# Altium project Banker.PrjPCB (part 1 of 5)
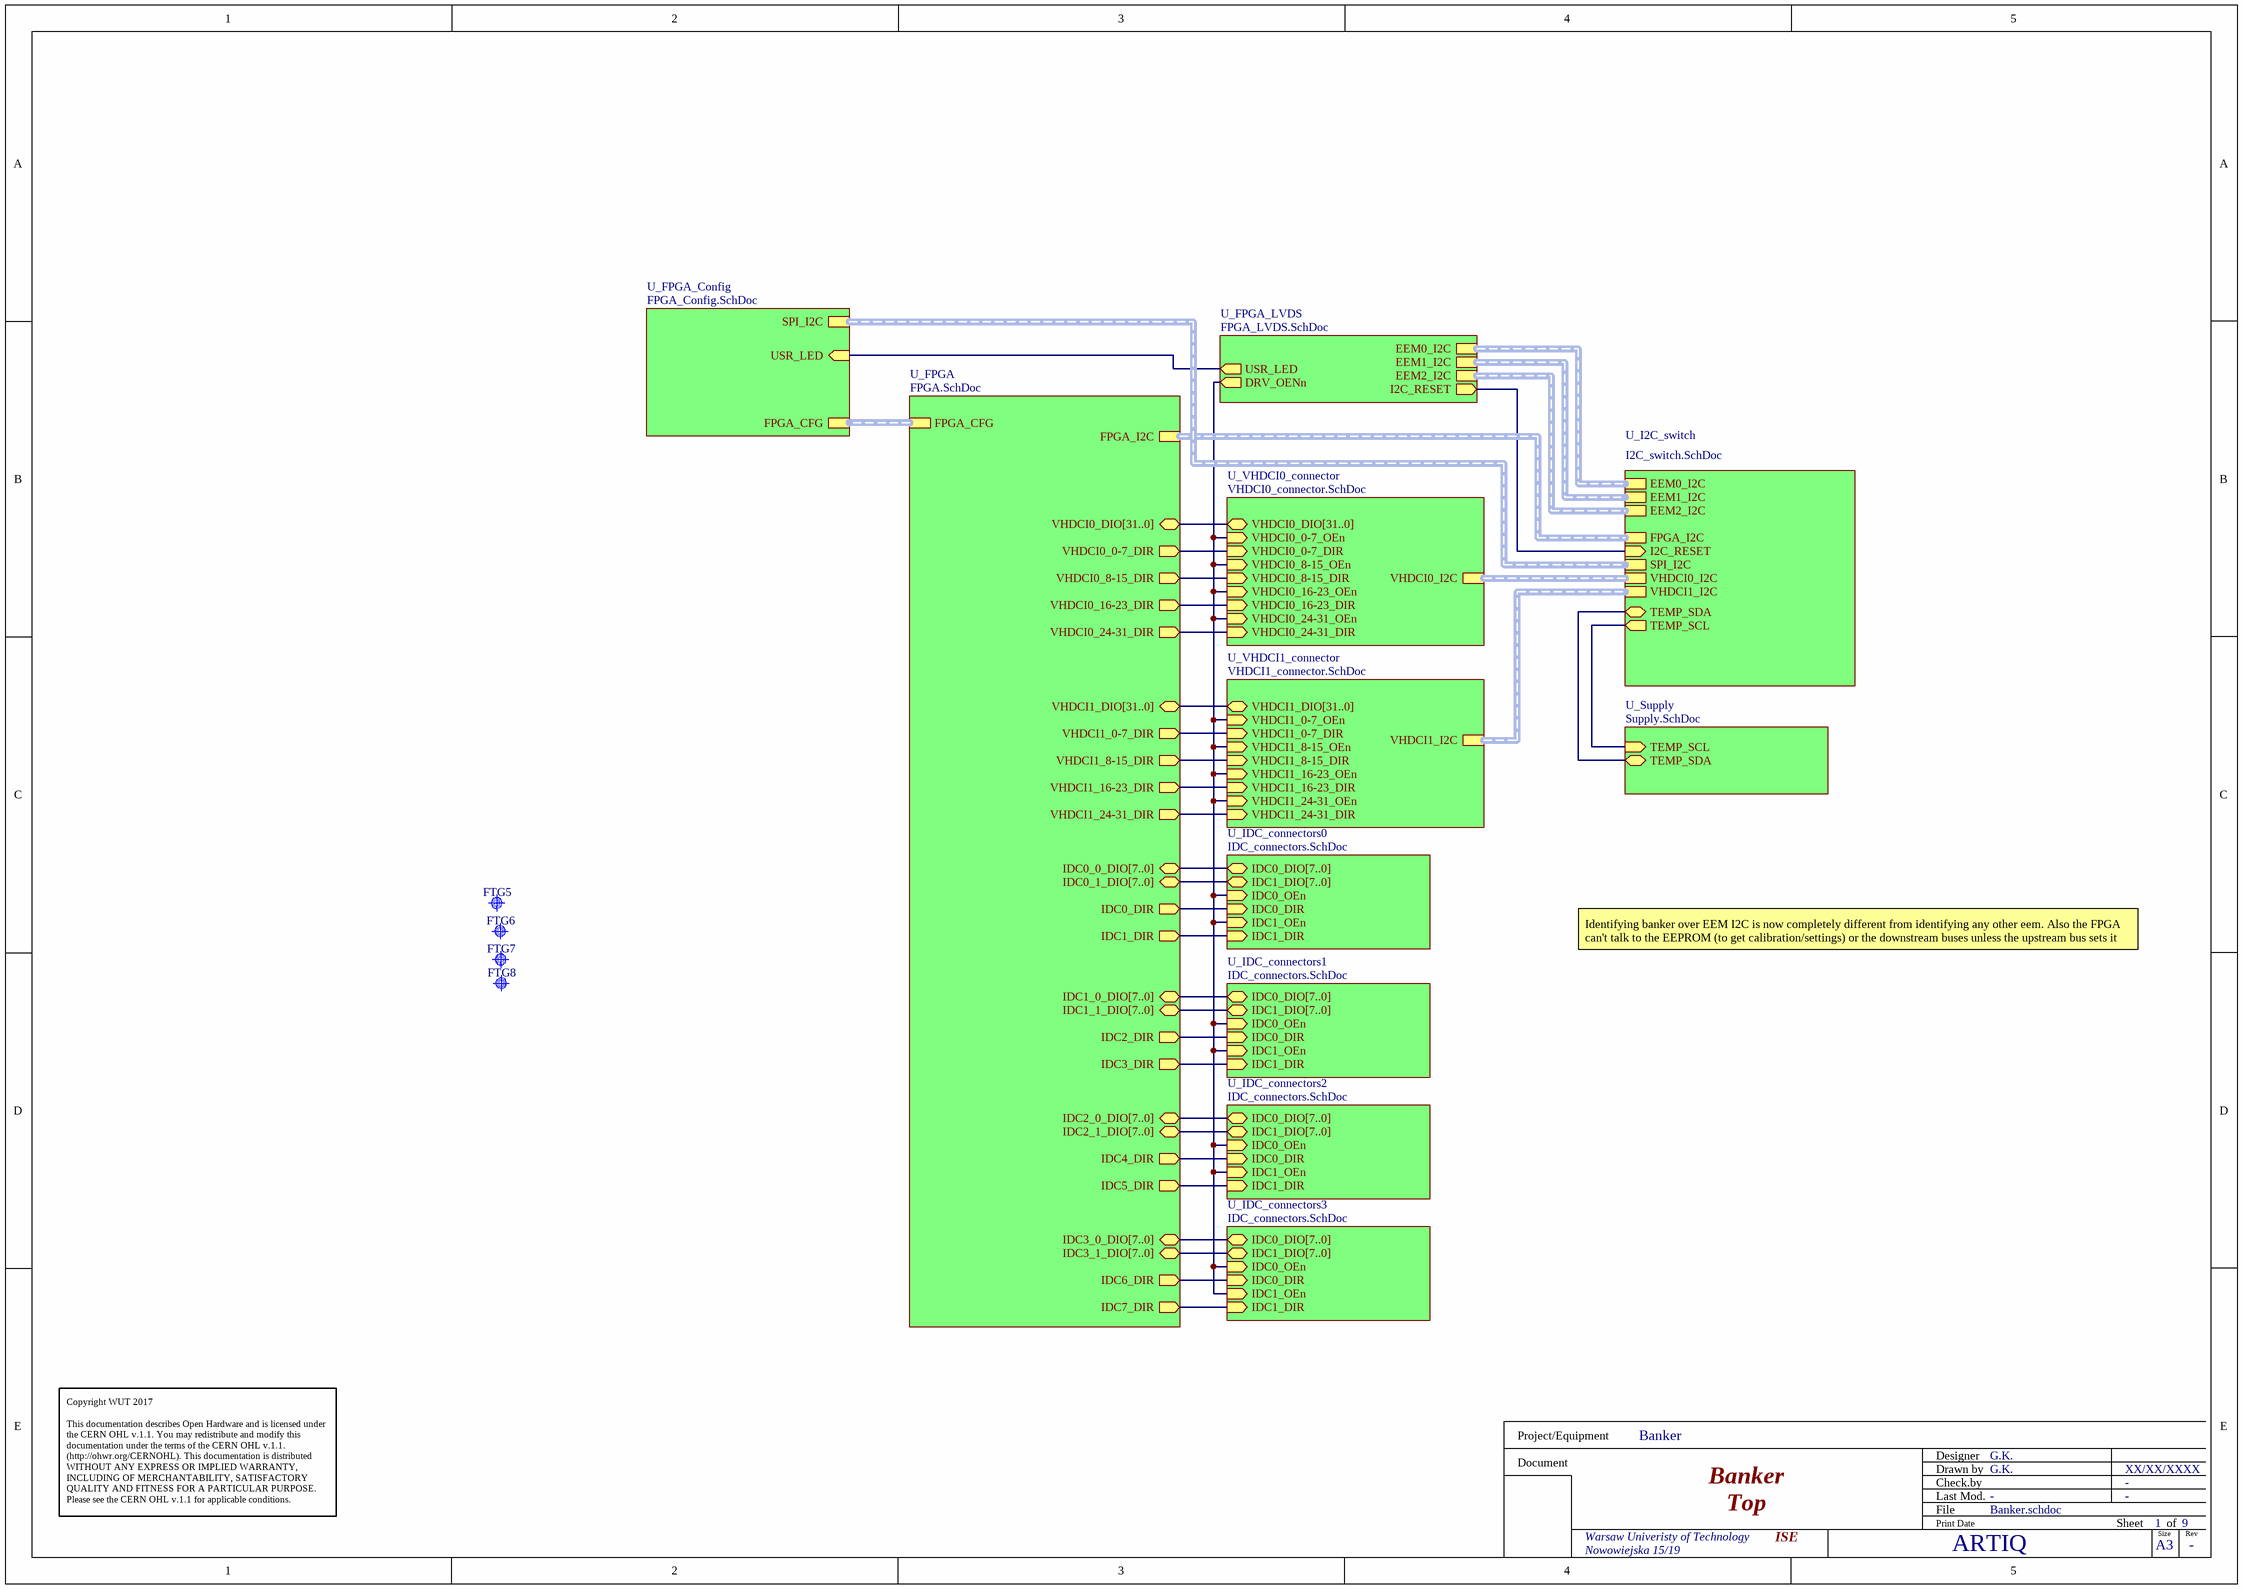
[diagram p0: Banker.schdoc]
9 sheets, 525 parts. Net scope: hierarchical (ports join the sheet entries above them; power ports are global).
Board files: Banker.PCBDOC, Panel_Banker.PcbDoc
Sheets:
  Banker.schdoc
    U_FPGA_LVDS = FPGA_LVDS.SchDoc
    U_VHDCI0_connector = VHDCI0_connector.SchDoc
    U_IDC_connectors0 = IDC_connectors.SchDoc
    U_VHDCI1_connector = VHDCI1_connector.SchDoc
    U_IDC_connectors1 = IDC_connectors.SchDoc
    U_IDC_connectors2 = IDC_connectors.SchDoc
    U_IDC_connectors3 = IDC_connectors.SchDoc
    U_FPGA = FPGA.SchDoc
    U_I2C_switch = I2C_switch.SchDoc
    U_Supply = Supply.SchDoc
    U_FPGA_Config = FPGA_Config.SchDoc

## Sheet Banker.schdoc: Banker
size 420 x 297 mm; Author: G.K.; CompanyName: WUT; DrawnBy: G.K.; Organization: CERN; Address1: Warsaw Univeristy of Technology; Address2: Nowowiejska 15/19; DocumentNumber: 1; Revision: -; SheetNumber: 1; SheetTotal: 9; EDA_Number: ARTIQ; Projet: Banker; ModifiedBy: -; CreateDate: XX/XX/XXXX; CheckedDate: -; Title2: Top; DivGrp: ISE; Designer: G.K.; ModifiedDate: -; ProjectName: ADC/DAC MEZZANINE

### Parts
FTG5  Use only in PCB  [FIDUCIAL_TOP_C100-200]  (value not drawn)
FTG6  Use only in PCB  [FIDUCIAL_TOP_S100-200]  (value not drawn)
FTG7  Use only in PCB  [FIDUCIAL_TOP_S200-400]  (value not drawn)
FTG8  Use only in PCB  [FIDUCIAL_TOP_S100-200]  (value not drawn)

### Sub-sheets
U_FPGA = FPGA.SchDoc: VHDCI0_DIO[31..0] (bidir), VHDCI1_DIO[31..0] (bidir), IDC0_0_DIO[7..0] (bidir), IDC0_1_DIO[7..0] (bidir), IDC0_DIR (out), IDC1_DIR (out), VHDCI1_0-7_DIR (out), VHDCI1_8-15_DIR (out), VHDCI1_16-23_DIR (out), VHDCI1_24-31_DIR (out), VHDCI0_0-7_DIR (out), VHDCI0_8-15_DIR (out), VHDCI0_16-23_DIR (out), VHDCI0_24-31_DIR (out), IDC2_DIR (out), IDC3_DIR (out), IDC1_0_DIO[7..0] (bidir), IDC1_1_DIO[7..0] (bidir), IDC2_0_DIO[7..0] (bidir), IDC2_1_DIO[7..0] (bidir), IDC3_0_DIO[7..0] (bidir), IDC3_1_DIO[7..0] (bidir), IDC7_DIR (out), IDC6_DIR (out), IDC4_DIR (out), IDC5_DIR (out), FPGA_I2C (harness I2C), FPGA_CFG (harness FPGA_CFG)
U_FPGA_Config = FPGA_Config.SchDoc: FPGA_CFG (harness FPGA_CFG), SPI_I2C (harness I2C), USR_LED (in)
U_FPGA_LVDS = FPGA_LVDS.SchDoc: EEM0_I2C (harness I2C), EEM1_I2C (harness I2C), EEM2_I2C (harness I2C), USR_LED (out), I2C_RESET (out), DRV_OENn (out)
U_I2C_switch = I2C_switch.SchDoc: EEM0_I2C (harness I2C), EEM1_I2C (harness I2C), VHDCI0_I2C (harness I2C), VHDCI1_I2C (harness I2C), EEM2_I2C (harness I2C), FPGA_I2C (harness I2C), SPI_I2C (harness I2C), I2C_RESET (in), TEMP_SCL (out), TEMP_SDA (bidir)
U_IDC_connectors0 = IDC_connectors.SchDoc: IDC0_DIO[7..0] (bidir), IDC1_DIO[7..0] (bidir), IDC0_OEn (in), IDC0_DIR (in), IDC1_DIR (in), IDC1_OEn (in)
U_IDC_connectors1 = IDC_connectors.SchDoc: IDC0_DIO[7..0] (bidir), IDC1_DIO[7..0] (bidir), IDC0_OEn (in), IDC0_DIR (in), IDC1_DIR (in), IDC1_OEn (in)
U_IDC_connectors2 = IDC_connectors.SchDoc: IDC0_DIO[7..0] (bidir), IDC1_DIO[7..0] (bidir), IDC0_OEn (in), IDC0_DIR (in), IDC1_DIR (in), IDC1_OEn (in)
U_IDC_connectors3 = IDC_connectors.SchDoc: IDC0_DIO[7..0] (bidir), IDC1_DIO[7..0] (bidir), IDC0_OEn (in), IDC0_DIR (in), IDC1_DIR (in), IDC1_OEn (in)
U_Supply = Supply.SchDoc: TEMP_SCL (in), TEMP_SDA (bidir)
U_VHDCI0_connector = VHDCI0_connector.SchDoc: VHDCI0_I2C (harness I2C), VHDCI0_DIO[31..0] (bidir), VHDCI0_0-7_OEn (in), VHDCI0_0-7_DIR (in), VHDCI0_8-15_OEn (in), VHDCI0_8-15_DIR (in), VHDCI0_16-23_OEn (in), VHDCI0_16-23_DIR (in), VHDCI0_24-31_OEn (in), VHDCI0_24-31_DIR (in)
U_VHDCI1_connector = VHDCI1_connector.SchDoc: VHDCI1_DIO[31..0] (bidir), VHDCI1_I2C (harness I2C), VHDCI1_0-7_OEn (in), VHDCI1_0-7_DIR (in), VHDCI1_8-15_OEn (in), VHDCI1_8-15_DIR (in), VHDCI1_16-23_OEn (in), VHDCI1_16-23_DIR (in), VHDCI1_24-31_OEn (in), VHDCI1_24-31_DIR (in)

### Nets
DRV_OENn: sheet U_FPGA_LVDS/DRV_OENn, sheet U_VHDCI0_connector/VHDCI0_0-7_OEn, sheet U_VHDCI0_connector/VHDCI0_8-15_OEn, sheet U_VHDCI0_connector/VHDCI0_16-23_OEn, sheet U_VHDCI0_connector/VHDCI0_24-31_OEn, sheet U_IDC_connectors0/IDC0_OEn, sheet U_IDC_connectors0/IDC1_OEn, sheet U_VHDCI1_connector/VHDCI1_0-7_OEn, sheet U_VHDCI1_connector/VHDCI1_8-15_OEn, sheet U_VHDCI1_connector/VHDCI1_16-23_OEn, sheet U_VHDCI1_connector/VHDCI1_24-31_OEn, sheet U_IDC_connectors1/IDC0_OEn, sheet U_IDC_connectors1/IDC1_OEn, sheet U_IDC_connectors2/IDC0_OEn, sheet U_IDC_connectors2/IDC1_OEn, sheet U_IDC_connectors3/IDC0_OEn, sheet U_IDC_connectors3/IDC1_OEn
IDC0_DIR: sheet U_IDC_connectors0/IDC0_DIR, sheet U_FPGA/IDC0_DIR
IDC1_DIR: sheet U_IDC_connectors0/IDC1_DIR, sheet U_FPGA/IDC1_DIR
IDC2_DIR: sheet U_IDC_connectors1/IDC0_DIR, sheet U_FPGA/IDC2_DIR
IDC3_DIR: sheet U_IDC_connectors1/IDC1_DIR, sheet U_FPGA/IDC3_DIR
IDC4_DIR: sheet U_IDC_connectors2/IDC0_DIR, sheet U_FPGA/IDC4_DIR
IDC5_DIR: sheet U_IDC_connectors2/IDC1_DIR, sheet U_FPGA/IDC5_DIR
IDC6_DIR: sheet U_IDC_connectors3/IDC0_DIR, sheet U_FPGA/IDC6_DIR
IDC7_DIR: sheet U_IDC_connectors3/IDC1_DIR, sheet U_FPGA/IDC7_DIR
TEMP_SCL: sheet U_I2C_switch/TEMP_SCL, sheet U_Supply/TEMP_SCL
TEMP_SDA: sheet U_I2C_switch/TEMP_SDA, sheet U_Supply/TEMP_SDA
USR_LED: sheet U_FPGA_LVDS/USR_LED, sheet U_FPGA_Config/USR_LED
VHDCI0_0-7_DIR: sheet U_VHDCI0_connector/VHDCI0_0-7_DIR, sheet U_FPGA/VHDCI0_0-7_DIR
VHDCI0_8-15_DIR: sheet U_VHDCI0_connector/VHDCI0_8-15_DIR, sheet U_FPGA/VHDCI0_8-15_DIR
VHDCI0_16-23_DIR: sheet U_VHDCI0_connector/VHDCI0_16-23_DIR, sheet U_FPGA/VHDCI0_16-23_DIR
VHDCI0_24-31_DIR: sheet U_VHDCI0_connector/VHDCI0_24-31_DIR, sheet U_FPGA/VHDCI0_24-31_DIR
VHDCI1_0-7_DIR: sheet U_VHDCI1_connector/VHDCI1_0-7_DIR, sheet U_FPGA/VHDCI1_0-7_DIR
VHDCI1_8-15_DIR: sheet U_VHDCI1_connector/VHDCI1_8-15_DIR, sheet U_FPGA/VHDCI1_8-15_DIR
VHDCI1_16-23_DIR: sheet U_VHDCI1_connector/VHDCI1_16-23_DIR, sheet U_FPGA/VHDCI1_16-23_DIR
VHDCI1_24-31_DIR: sheet U_VHDCI1_connector/VHDCI1_24-31_DIR, sheet U_FPGA/VHDCI1_24-31_DIR
NetR148_1: sheet U_FPGA_LVDS/I2C_RESET, sheet U_I2C_switch/I2C_RESET

### Buses and harness runs
bus sheet U_FPGA/IDC0_0_DIO[7..0] = sheet U_IDC_connectors0/IDC0_DIO[7..0]
bus sheet U_FPGA/IDC0_1_DIO[7..0] = sheet U_IDC_connectors0/IDC1_DIO[7..0]
bus sheet U_FPGA/IDC1_0_DIO[7..0] = sheet U_IDC_connectors1/IDC0_DIO[7..0]
bus sheet U_FPGA/IDC1_1_DIO[7..0] = sheet U_IDC_connectors1/IDC1_DIO[7..0]
bus sheet U_FPGA/IDC2_0_DIO[7..0] = sheet U_IDC_connectors2/IDC0_DIO[7..0]
bus sheet U_FPGA/IDC2_1_DIO[7..0] = sheet U_IDC_connectors2/IDC1_DIO[7..0]
bus sheet U_FPGA/IDC3_0_DIO[7..0] = sheet U_IDC_connectors3/IDC0_DIO[7..0]
bus sheet U_FPGA/IDC3_1_DIO[7..0] = sheet U_IDC_connectors3/IDC1_DIO[7..0]
bus sheet U_FPGA/VHDCI0_DIO[31..0] = sheet U_VHDCI0_connector/VHDCI0_DIO[31..0]
bus sheet U_FPGA/VHDCI1_DIO[31..0] = sheet U_VHDCI1_connector/VHDCI1_DIO[31..0]
harness sheet U_FPGA/FPGA_CFG = sheet U_FPGA_Config/FPGA_CFG
harness sheet U_FPGA/FPGA_I2C = sheet U_I2C_switch/FPGA_I2C
harness sheet U_FPGA_Config/SPI_I2C = sheet U_I2C_switch/SPI_I2C
harness sheet U_FPGA_LVDS/EEM0_I2C = sheet U_I2C_switch/EEM0_I2C
harness sheet U_FPGA_LVDS/EEM1_I2C = sheet U_I2C_switch/EEM1_I2C
harness sheet U_FPGA_LVDS/EEM2_I2C = sheet U_I2C_switch/EEM2_I2C
harness sheet U_I2C_switch/VHDCI0_I2C = sheet U_VHDCI0_connector/VHDCI0_I2C
harness sheet U_I2C_switch/VHDCI1_I2C = sheet U_VHDCI1_connector/VHDCI1_I2C

### Notes on the sheet
- Identifying banker over EEM I2C is now completely different from identifying any other eem. Also the FPGA can't talk to the EEPROM (to get calibration/settings) or the downstream buses unless the upstream bus sets it up.
- Copyright WUT 2017
  This documentation describes Open Hardware and is licensed under the CERN OHL v.1.1. You may redistribute and modify this documentation under the terms of the CERN OHL v.1.1. (http://ohwr.org/CERNOHL). This documentation is distributed WITHOUT ANY EXPRESS OR IMPLIED WARRANTY, INCLUDING OF MERCHANTABILITY, SATISFACTORY QUALITY AND FITNESS FOR A PARTICULAR PURPOSE. Please see the CERN OHL v.1.1 for applicable conditions.
- Project/Equipment
- Document
- Designer
- Drawn by
- Check.by
- File
- Last Mod.
- Print Date
- Sheet
- Size
- A3
- of
- Rev

### Library data of the parts
FTG5 = FIDUCIAL_TARGET_C100-200: Fiducial Target; Part Description: Round Fiducial Target, Top Layer, 1.0mm, Top Solder 2.0mm, Keepout =2.0mm; Mounted: No; Part Number: FIDUCIAL_TARGET_C100-200; Component Kind: Standard (No BOM); Component Type: Standard (No BOM); Pin Count: 1; Family: Fiducial; Socket: No; SMD: Yes; Sense: No; Status: None; ComponentHeight: 0mm; HelpURL: Undefined; Author: CERN DEM JLC; CreateDate: 09.02.2010; LatestRevisionDate: 04.04.2012; PackageDescription: Round Fiducial Target, Top Layer, 1.0mm, Top Solder 2.0mm, Keepout =2.0mm
FTG6 FTG8 = FIDUCIAL_TARGET_S100-200: Fiducial Target; Part Description: Square Fiducial Target, Top Layer, 1.0mm, Top Solder 2.0mm, Keepout =2.0mm; Mounted: No; Part Number: FIDUCIAL_TARGET_S100-200; Component Kind: Standard (No BOM); Component Type: Standard (No BOM); Pin Count: 1; Family: Fiducial; Socket: No; SMD: Yes; Sense: No; Status: None; ComponentHeight: 0mm; HelpURL: Undefined; Author: CERN DEM JLC; CreateDate: 09.02.2010; LatestRevisionDate: 04.04.2012; PackageDescription: Square Fiducial Target, Top Layer, 1.0mm, Top Solder 2.0mm, Keepout =2.0mm
FTG7 = FIDUCIAL_TARGET_S200-400: Fiducial Target; Part Description: Square Fiducial Target, Top Layer, 2.0mm, Top Solder 4.0mm, Keepout =4.0mm; Mounted: No; Part Number: FIDUCIAL_TARGET_S200-400; Component Kind: Standard (No BOM); Component Type: Standard (No BOM); Pin Count: 1; Family: Fiducial; Socket: No; SMD: Yes; Sense: No; Status: None; ComponentHeight: 0mm; HelpURL: Undefined; Author: CERN DEM JLC; CreateDate: 02.06.2008; LatestRevisionDate: 04.04.2012; PackageDescription: Square Fiducial Target, Top Layer, 2.0mm, Top Solder 4.0mm, Keepout =4.0mm

## Sheet FPGA_LVDS.SchDoc: FPGA LVDS bank
size 420 x 297 mm; Author: G.K.; CompanyName: WUT; DrawnBy: G.K.; Organization: CERN; Address1: Warsaw Univeristy of Technology; Address2: Nowowiejska 15/19; DocumentNumber: 6; Revision: -; SheetNumber: 6; SheetTotal: 9; EDA_Number: ARTIQ; Projet: Banker; ModifiedBy: -; CreateDate: XX/XX/XXXX; CheckedDate: -; Title2: EEM connector; DivGrp: ISE; Designer: G.K.; ModifiedDate: -; ProjectName: ADC/DAC MEZZANINE
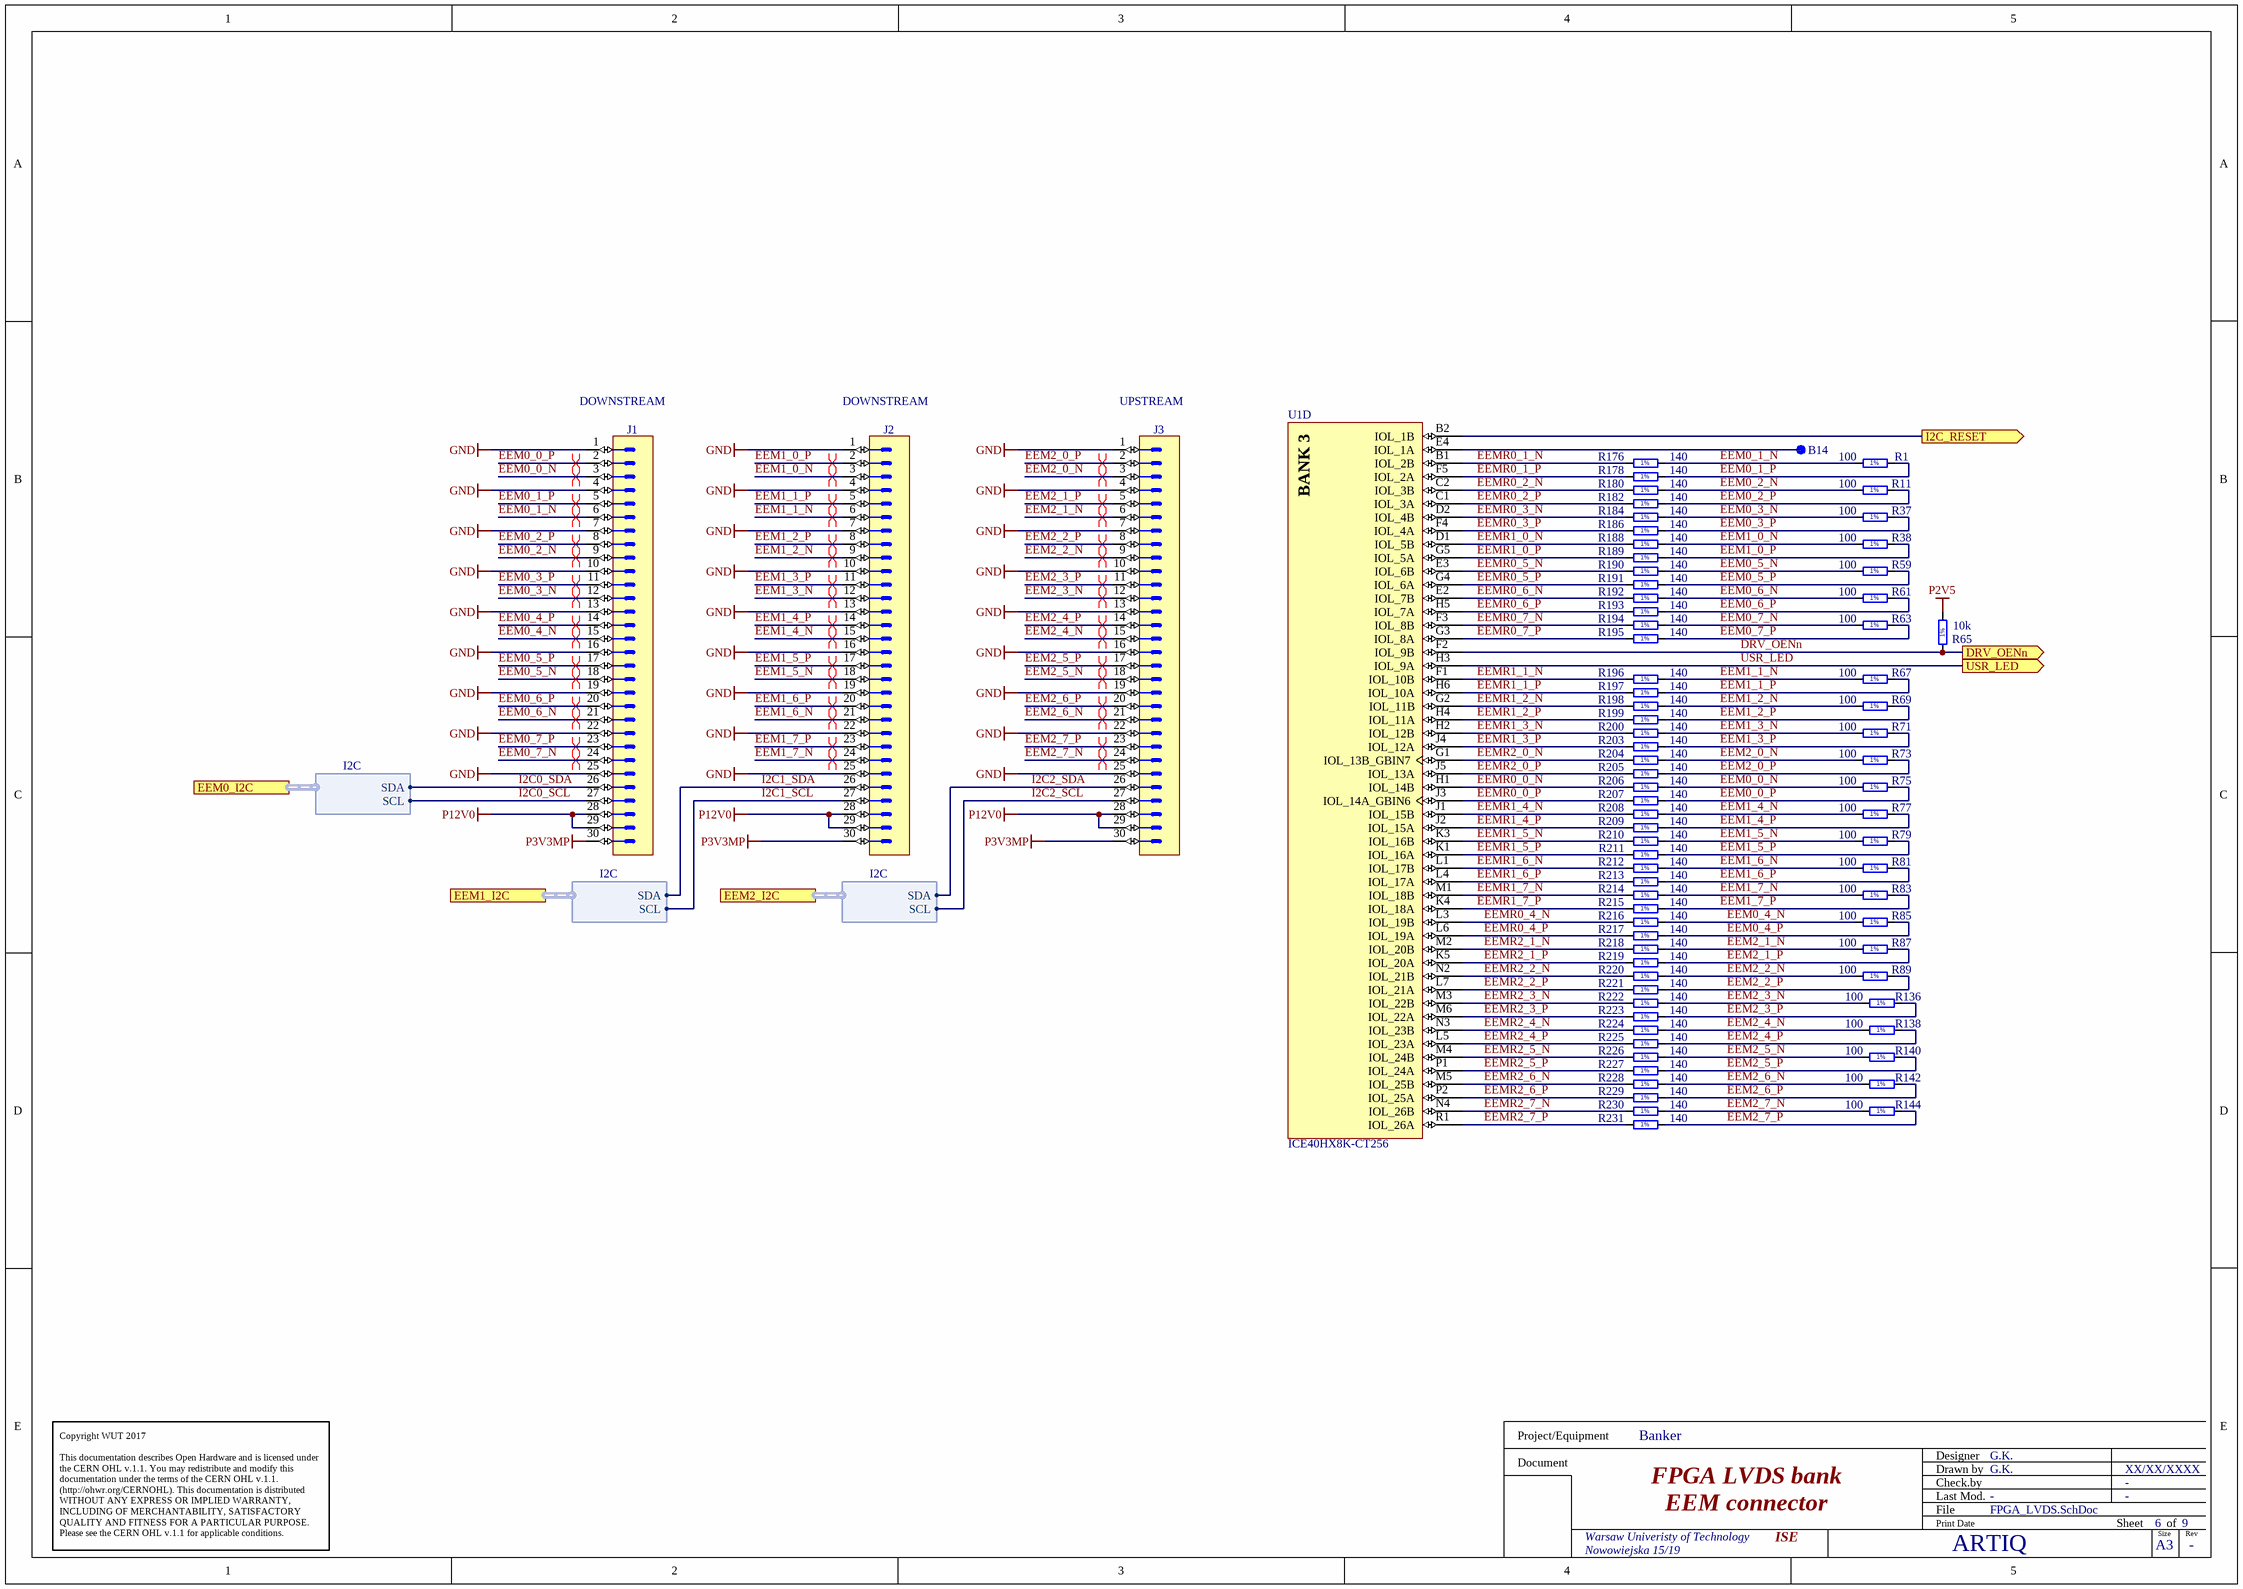
[diagram p1: FPGA_LVDS.SchDoc]

### Parts
B14  SMD Pad  [C100]  (value not drawn)
J1  (no value)  [3M_N2530-6002RB]
J2  (no value)  [3M_N2530-6002RB]
J3  (no value)  [3M_N2530-6002RB]
R1  100  [RESC1005X40N]
R11  100  [RESC1005X40N]
R37  100  [RESC1005X40N]
R38  100  [RESC1005X40N]
R59  100  [RESC1005X40N]
R61  100  [RESC1005X40N]
R63  100  [RESC1005X40N]
R65  10k  [RESC1005X40N]
R67  100  [RESC1005X40N]
R69  100  [RESC1005X40N]
R71  100  [RESC1005X40N]
R73  100  [RESC1005X40N]
R75  100  [RESC1005X40N]
R77  100  [RESC1005X40N]
R79  100  [RESC1005X40N]
R81  100  [RESC1005X40N]
R83  100  [RESC1005X40N]
R85  100  [RESC1005X40N]
R87  100  [RESC1005X40N]
R89  100  [RESC1005X40N]
R136  100  [RESC1005X40N]
R138  100  [RESC1005X40N]
R140  100  [RESC1005X40N]
R142  100  [RESC1005X40N]
R144  100  [RESC1005X40N]
R176  140  [RESC0603X28N]
R178  140  [RESC0603X28N]
R180  140  [RESC0603X28N]
R182  140  [RESC0603X28N]
R184  140  [RESC0603X28N]
R186  140  [RESC0603X28N]
R188  140  [RESC0603X28N]
R189  140  [RESC0603X28N]
R190  140  [RESC0603X28N]
R191  140  [RESC0603X28N]
R192  140  [RESC0603X28N]
R193  140  [RESC0603X28N]
R194  140  [RESC0603X28N]
R195  140  [RESC0603X28N]
R196  140  [RESC0603X28N]
R197  140  [RESC0603X28N]
R198  140  [RESC0603X28N]
R199  140  [RESC0603X28N]
R200  140  [RESC0603X28N]
R203  140  [RESC0603X28N]
R204  140  [RESC0603X28N]
R205  140  [RESC0603X28N]
R206  140  [RESC0603X28N]
R207  140  [RESC0603X28N]
R208  140  [RESC0603X28N]
R209  140  [RESC0603X28N]
R210  140  [RESC0603X28N]
R211  140  [RESC0603X28N]
R212  140  [RESC0603X28N]
R213  140  [RESC0603X28N]
R214  140  [RESC0603X28N]
R215  140  [RESC0603X28N]
R216  140  [RESC0603X28N]
R217  140  [RESC0603X28N]
R218  140  [RESC0603X28N]
R219  140  [RESC0603X28N]
R220  140  [RESC0603X28N]
R221  140  [RESC0603X28N]
R222  140  [RESC0603X28N]
R223  140  [RESC0603X28N]
R224  140  [RESC0603X28N]
R225  140  [RESC0603X28N]
R226  140  [RESC0603X28N]
R227  140  [RESC0603X28N]
R228  140  [RESC0603X28N]
R229  140  [RESC0603X28N]
R230  140  [RESC0603X28N]
R231  140  [RESC0603X28N]
U1  ICE40HX8K-CT256  [LATC-caBGA-256]  (part D of 5)

### Ports
DRV_OENn (out), EEM0_I2C (harness I2C), EEM1_I2C (harness I2C), EEM2_I2C (harness I2C), I2C_RESET (out), USR_LED (out)

### Harnesses
I2C: SDA, SCL

### Nets
GND: J1.1 J1.4 J1.7 J1.10 J1.13 J1.16 J1.19 J1.22 J1.25 J2.1 J2.4 J2.7 J2.10 J2.13 J2.16 J2.19 J2.22 J2.25 J3.1 J3.4 J3.7 J3.10 J3.13 J3.16 J3.19 J3.22 J3.25
P2V5: R65.2
P3V3MP: J1.30 J2.30 J3.30
P12V0: J1.28 J1.29 J2.28 J2.29 J3.28 J3.29
DRV_OENn: R65.1 U1.F2(IOL_9B) ; port DRV_OENn
EEM0_0_N: J1.3 R75.1 R206.2
EEM0_0_P: J1.2 R75.2 R207.2
EEM0_1_N: J1.6 R1.1 R176.2
EEM0_1_P: J1.5 R1.2 R178.2
EEM0_2_N: J1.9 R11.1 R180.2
EEM0_2_P: J1.8 R11.2 R182.2
EEM0_3_N: J1.12 R37.1 R184.2
EEM0_3_P: J1.11 R37.2 R186.2
EEM0_4_N: J1.15 R85.1 R216.2
EEM0_4_P: J1.14 R85.2 R217.2
EEM0_5_N: J1.18 R59.1 R190.2
EEM0_5_P: J1.17 R59.2 R191.2
EEM0_6_N: J1.21 R61.1 R192.2
EEM0_6_P: J1.20 R61.2 R193.2
EEM0_7_N: J1.24 R63.1 R194.2
EEM0_7_P: J1.23 R63.2 R195.2
EEM1_0_N: J2.3 R38.1 R188.2
EEM1_0_P: J2.2 R38.2 R189.2
EEM1_1_N: J2.6 R67.1 R196.2
EEM1_1_P: J2.5 R67.2 R197.2
EEM1_2_N: J2.9 R69.1 R198.2
EEM1_2_P: J2.8 R69.2 R199.2
EEM1_3_N: J2.12 R71.1 R200.2
EEM1_3_P: J2.11 R71.2 R203.2
EEM1_4_N: J2.15 R77.1 R208.2
EEM1_4_P: J2.14 R77.2 R209.2
EEM1_5_N: J2.18 R79.1 R210.2
EEM1_5_P: J2.17 R79.2 R211.2
EEM1_6_N: J2.21 R81.1 R212.2
EEM1_6_P: J2.20 R81.2 R213.2
EEM1_7_N: J2.24 R83.1 R214.2
EEM1_7_P: J2.23 R83.2 R215.2
EEM2_0_N: J3.3 R73.1 R204.2
EEM2_0_P: J3.2 R73.2 R205.2
EEM2_1_N: J3.6 R87.1 R218.2
EEM2_1_P: J3.5 R87.2 R219.2
EEM2_2_N: J3.9 R89.1 R220.2
EEM2_2_P: J3.8 R89.2 R221.2
EEM2_3_N: J3.12 R136.1 R222.2
EEM2_3_P: J3.11 R136.2 R223.2
EEM2_4_N: J3.15 R138.1 R224.2
EEM2_4_P: J3.14 R138.2 R225.2
EEM2_5_N: J3.18 R140.1 R226.2
EEM2_5_P: J3.17 R140.2 R227.2
EEM2_6_N: J3.21 R142.1 R228.2
EEM2_6_P: J3.20 R142.2 R229.2
EEM2_7_N: J3.24 R144.1 R230.2
EEM2_7_P: J3.23 R144.2 R231.2
EEMR0_0_N: R206.1 U1.H1(IOL_14B)
EEMR0_0_P: R207.1 U1.J3(IOL_14A_GBIN6)
EEMR0_1_N: R176.1 U1.B1(IOL_2B)
EEMR0_1_P: R178.1 U1.F5(IOL_2A)
EEMR0_2_N: R180.1 U1.C2(IOL_3B)
EEMR0_2_P: R182.1 U1.C1(IOL_3A)
EEMR0_3_N: R184.1 U1.D2(IOL_4B)
EEMR0_3_P: R186.1 U1.F4(IOL_4A)
EEMR0_4_N: R216.1 U1.L3(IOL_19B)
EEMR0_4_P: R217.1 U1.L6(IOL_19A)
EEMR0_5_N: R190.1 U1.E3(IOL_6B)
EEMR0_5_P: R191.1 U1.G4(IOL_6A)
EEMR0_6_N: R192.1 U1.E2(IOL_7B)
EEMR0_6_P: R193.1 U1.H5(IOL_7A)
EEMR0_7_N: R194.1 U1.F3(IOL_8B)
EEMR0_7_P: R195.1 U1.G3(IOL_8A)
EEMR1_0_N: R188.1 U1.D1(IOL_5B)
EEMR1_0_P: R189.1 U1.G5(IOL_5A)
EEMR1_1_N: R196.1 U1.F1(IOL_10B)
EEMR1_1_P: R197.1 U1.H6(IOL_10A)
EEMR1_2_N: R198.1 U1.G2(IOL_11B)
EEMR1_2_P: R199.1 U1.H4(IOL_11A)
EEMR1_3_N: R200.1 U1.H2(IOL_12B)
EEMR1_3_P: R203.1 U1.J4(IOL_12A)
EEMR1_4_N: R208.1 U1.J1(IOL_15B)
EEMR1_4_P: R209.1 U1.J2(IOL_15A)
EEMR1_5_N: R210.1 U1.K3(IOL_16B)
EEMR1_5_P: R211.1 U1.K1(IOL_16A)
EEMR1_6_N: R212.1 U1.L1(IOL_17B)
EEMR1_6_P: R213.1 U1.L4(IOL_17A)
EEMR1_7_N: R214.1 U1.M1(IOL_18B)
EEMR1_7_P: R215.1 U1.K4(IOL_18A)
EEMR2_0_N: R204.1 U1.G1(IOL_13B_GBIN7)
EEMR2_0_P: R205.1 U1.J5(IOL_13A)
EEMR2_1_N: R218.1 U1.M2(IOL_20B)
EEMR2_1_P: R219.1 U1.K5(IOL_20A)
EEMR2_2_N: R220.1 U1.N2(IOL_21B)
EEMR2_2_P: R221.1 U1.L7(IOL_21A)
EEMR2_3_N: R222.1 U1.M3(IOL_22B)
EEMR2_3_P: R223.1 U1.M6(IOL_22A)
EEMR2_4_N: R224.1 U1.N3(IOL_23B)
EEMR2_4_P: R225.1 U1.L5(IOL_23A)
EEMR2_5_N: R226.1 U1.M4(IOL_24B)
EEMR2_5_P: R227.1 U1.P1(IOL_24A)
EEMR2_6_N: R228.1 U1.M5(IOL_25B)
EEMR2_6_P: R229.1 U1.P2(IOL_25A)
EEMR2_7_N: R230.1 U1.N4(IOL_26B)
EEMR2_7_P: R231.1 U1.R1(IOL_26A)
I2C0_SCL: J1.27 ; port EEM0_I2C.SCL  [project net EEM0_I2C_SCL]
I2C0_SDA: J1.26 ; port EEM0_I2C.SDA  [project net EEM0_I2C_SDA]
I2C1_SCL: J2.27 ; port EEM1_I2C.SCL  [project net EEM1_I2C_SCL]
I2C1_SDA: J2.26 ; port EEM1_I2C.SDA  [project net EEM1_I2C_SDA]
I2C2_SCL: J3.27 ; port EEM2_I2C.SCL  [project net EEM2_I2C_SCL]
I2C2_SDA: J3.26 ; port EEM2_I2C.SDA  [project net EEM2_I2C_SDA]
USR_LED: U1.H3(IOL_9A) ; port USR_LED
NetB14_1: B14.1 U1.E4(IOL_1A)
NetR148_1: U1.B2(IOL_1B) ; port I2C_RESET

### Layout directives
differential pair: EEM0_0_N, EEM0_0_P, EEM0_1_N, EEM0_1_P, EEM0_2_N, EEM0_2_P, EEM0_3_N, EEM0_3_P, EEM0_4_N, EEM0_4_P, EEM0_5_N, EEM0_5_P, EEM0_6_N, EEM0_6_P, EEM0_7_N, EEM0_7_P, EEM1_0_N, EEM1_0_P, EEM1_1_N, EEM1_1_P, EEM1_2_N, EEM1_2_P, EEM1_3_N, EEM1_3_P, EEM1_4_N, EEM1_4_P, EEM1_5_N, EEM1_5_P, EEM1_6_N, EEM1_6_P, EEM1_7_N, EEM1_7_P, EEM2_0_N, EEM2_0_P, EEM2_1_N, EEM2_1_P, EEM2_2_N, EEM2_2_P, EEM2_3_N, EEM2_3_P, EEM2_4_N, EEM2_4_P, EEM2_5_N, EEM2_5_P, EEM2_6_N, EEM2_6_P, EEM2_7_N, EEM2_7_P

### Notes on the sheet
- (near J1) DOWNSTREAM
- (near J2) DOWNSTREAM
- (near J3) UPSTREAM
- Copyright WUT 2017
  This documentation describes Open Hardware and is licensed under the CERN OHL v.1.1. You may redistribute and modify this documentation under the terms of the CERN OHL v.1.1. (http://ohwr.org/CERNOHL). This documentation is distributed WITHOUT ANY EXPRESS OR IMPLIED WARRANTY, INCLUDING OF MERCHANTABILITY, SATISFACTORY QUALITY AND FITNESS FOR A PARTICULAR PURPOSE. Please see the CERN OHL v.1.1 for applicable conditions.
- Project/Equipment
- Document
- Designer
- Drawn by
- Check.by
- File
- Last Mod.
- Print Date
- Sheet
- Size
- A3
- of
- Rev
- (in symbol CMP-0962-00001-1, part D) BANK 3
- (in symbol R0201_140R_1%_0.05W_200PPM) 1%
- (in symbol R0402_10K_1%_0.0625W_100PPM) 1%
- (in symbol R0402_100R_1%_0.0625W_100PPM) 1%

### Library data of the parts
B14 = SMD_PAD_D1MM: Through Hole Pad; Part Description: 1mm Diameter SMD Pad; Mounted: No; Part Number: SMD_PAD_D1MM; Component Kind: Standard (No BOM); Component Type: Standard (No BOM); Pin Count: 1; Family: SMD Pad; Socket: No; SMD: No; Sense: No; Status: None; ComponentHeight: 0mm; HelpURL: Undefined; Author: CERN DEM JLC; CreateDate: 10.10.2017; LatestRevisionDate: 10.10.2017; PackageDescription: 1mm Diameter SMD Pad
J1-J3 = 3M_N2530-6002RB: Connector 30 Male; Part Description: 30 Contacts - Straight .100'' x .100'' Low Profile Four-Wall Header, 2500 Series; Manufacturer: 3M; PressFit: No; Part Number: 3M_N2530-6002RB; Component Kind: Standard; Component Type: Standard; Pin Count: 30; Family: Header 30; Mounted: Yes; Socket: No; SMD: No; Sense: No; Status: None; Manufacturer Part Number: N2530-6002RB; ComponentHeight: 10.03mm; HelpURL: \\cern.ch\dfs\Applications\Altium\Datasheets\3M_N2530-6002RB.pdf; Author: CERN DEM JLC; CreateDate: 11.02.2009; LatestRevisionDate: 11.08.2009
R1 R11 R37 R38 R59 R61 R63 R67 R69 R71 R73 R75 R77 R79 R81 R83 R85 R87 R89 R136 R138 R140 R142 R144 = R0402_100R_1%_0.0625W_100PPM: Resistor - 1%; Part Description: General Purpose Thick Film Chip Resistor; Manufacturer: GENERIC; Manufacturer1 Part Number: 232270671001L; TC: ±100ppm/°C; PressFit: No; Part Number: R0402_100R_1%_0.0625W_100PPM; Component Kind: Standard; Component Type: Standard; Pin Count: 2; Value: 100; Status: Not Recommended; Power: 0.0625W; Tolerance: ±1%; Manufacturer Part Number: R0402_100R_1%_0.0625W_100PPM; Case: 0402; Mounted: Yes; Sense: No; Socket: No; SMD: Yes; Manufacturer1 Example: YAGEO PHYCOMP; Manufacturer1 ComponentHeight: 0.4mm; HelpURL: \\cern.ch\dfs\Applications\Altium\Datasheets\R0402_Phycomp_RC0402.pdf; Author: CERN DEM JLC; CreateDate: 03/12/2007; LatestRevisionDate: 17/10/2012
R65 = R0402_10K_1%_0.0625W_100PPM: Resistor - 1%; Part Description: General Purpose Thick Film Chip Resistor; Manufacturer: GENERIC; Manufacturer1 Part Number: 232270671003L; TC: ±100ppm/°C; Table: Resistors SMD; Part Number: R0402_10K_1%_0.0625W_100PPM; Component Kind: Standard; Component Type: Standard; Pin Count: 2; Value: 10k; Status: Not recommended; Power: 0.0625W; Tolerance: ±1%; Manufacturer Part Number: R0402_10K_1%_0.0625W_100PPM; Case: 0402; Mounted: Yes; Socket: No; SMD: Yes; Manufacturer1 Example: YAGEO PHYCOMP; Manufacturer1 ComponentHeight: 0.4mm; HelpURL: \\cern.ch\dfs\Applications\Altium\Datasheets\R0402_Phycomp_RC0402.pdf; Author: CERN DEM JLC; CreateDate: 2007-12-03; LatestRevisionDate: 2012-10-17
R176 R178 R180 R182 R184 R186 R188-R200 R203-R231 = R0201_140R_1%_0.05W_200PPM: Resistor - 1%; Part Description: Thick Film Chip Resistor; Manufacturer: GENERIC; Manufacturer1 Part Number: CRCW0201140RFNED; Power: 0.05W; TC: ±200ppm/°C; PressFit: No; Part Number: R0201_140R_1%_0.05W_200PPM; Component Kind: Standard; Component Type: Standard; Pin Count: 2; Value: 140; Status: Not Recommended; Tolerance: ±1%; Manufacturer Part Number: R0201_140R_1%_0.05W_200PPM; Case: 0201; Mounted: Yes; Sense: No; Socket: No; SMD: Yes; Manufacturer1 Example: VISHAY; Manufacturer1 ComponentHeight: 0.27mm; HelpURL: \\cern.ch\dfs\Applications\Altium\Datasheets\R0201_VISHAY_CRCW e3.pdf; Author: CERN DEM MR; CreateDate: 26/01/2016; LatestRevisionDate: 26/01/2016
U1 = CMP-0962-00001-1: iCE40 HX8K Series FPGA Family, 7680 Logic Cells, 1.2 V Core, 128 K Embedded RAM Bits, 256-ball caBGA, Pb-Free, Tray; Manufacturer: Lattice Semiconductor; Supply Voltage: 1.2V; Phase-Locked Loops: 2; Logic Cells: 7680; Embedded RAM Bits: 128K; PackageReference: caBGA-256; PackageDescription: 256-Ball Chip Array Ball Grid Array, Body 14 x 14 mm, Pitch 0.8 mm; RoHS: TRUE; Packing: Tray; Mounting Technology: Surface Mount; ComponentLink3URL: http://www.latticesemi.com/lit/docs/package/pkg.pdf; ComponentLink1Description: Manufacturer URL; ComponentLink3Description: Package Specification; Code_JEDEC: MO-275; PackageVersion: Rev. 03.9, 02/2013; ComponentLink1URL: http://www.latticesemi.com/en; ComponentLink2URL: http://www.latticesemi.com/~/media/Documents/DataSheets/iCE/iCE40LPHXFamilyDataSheet.pdf; PartNumber: ICE40HX8K-CT256; ComponentLink2Description: Datasheet; DatasheetVersion: Rev. 02.9

## Sheet VHDCI0_connector.SchDoc: VHDCI 0
size 420 x 297 mm; Author: G.K.; CompanyName: WUT; DrawnBy: G.K.; Organization: CERN; Address1: Warsaw Univeristy of Technology; Address2: Nowowiejska 15/19; DocumentNumber: 4; Revision: -; SheetNumber: 4; SheetTotal: 10; EDA_Number: ARTIQ; Projet: Banker; ModifiedBy: -; CreateDate: XX/XX/XXXX; CheckedDate: -; Title2: Connector & driver; DivGrp: ISE; Designer: G.K.; ModifiedDate: -; ProjectName: ADC/DAC MEZZANINE
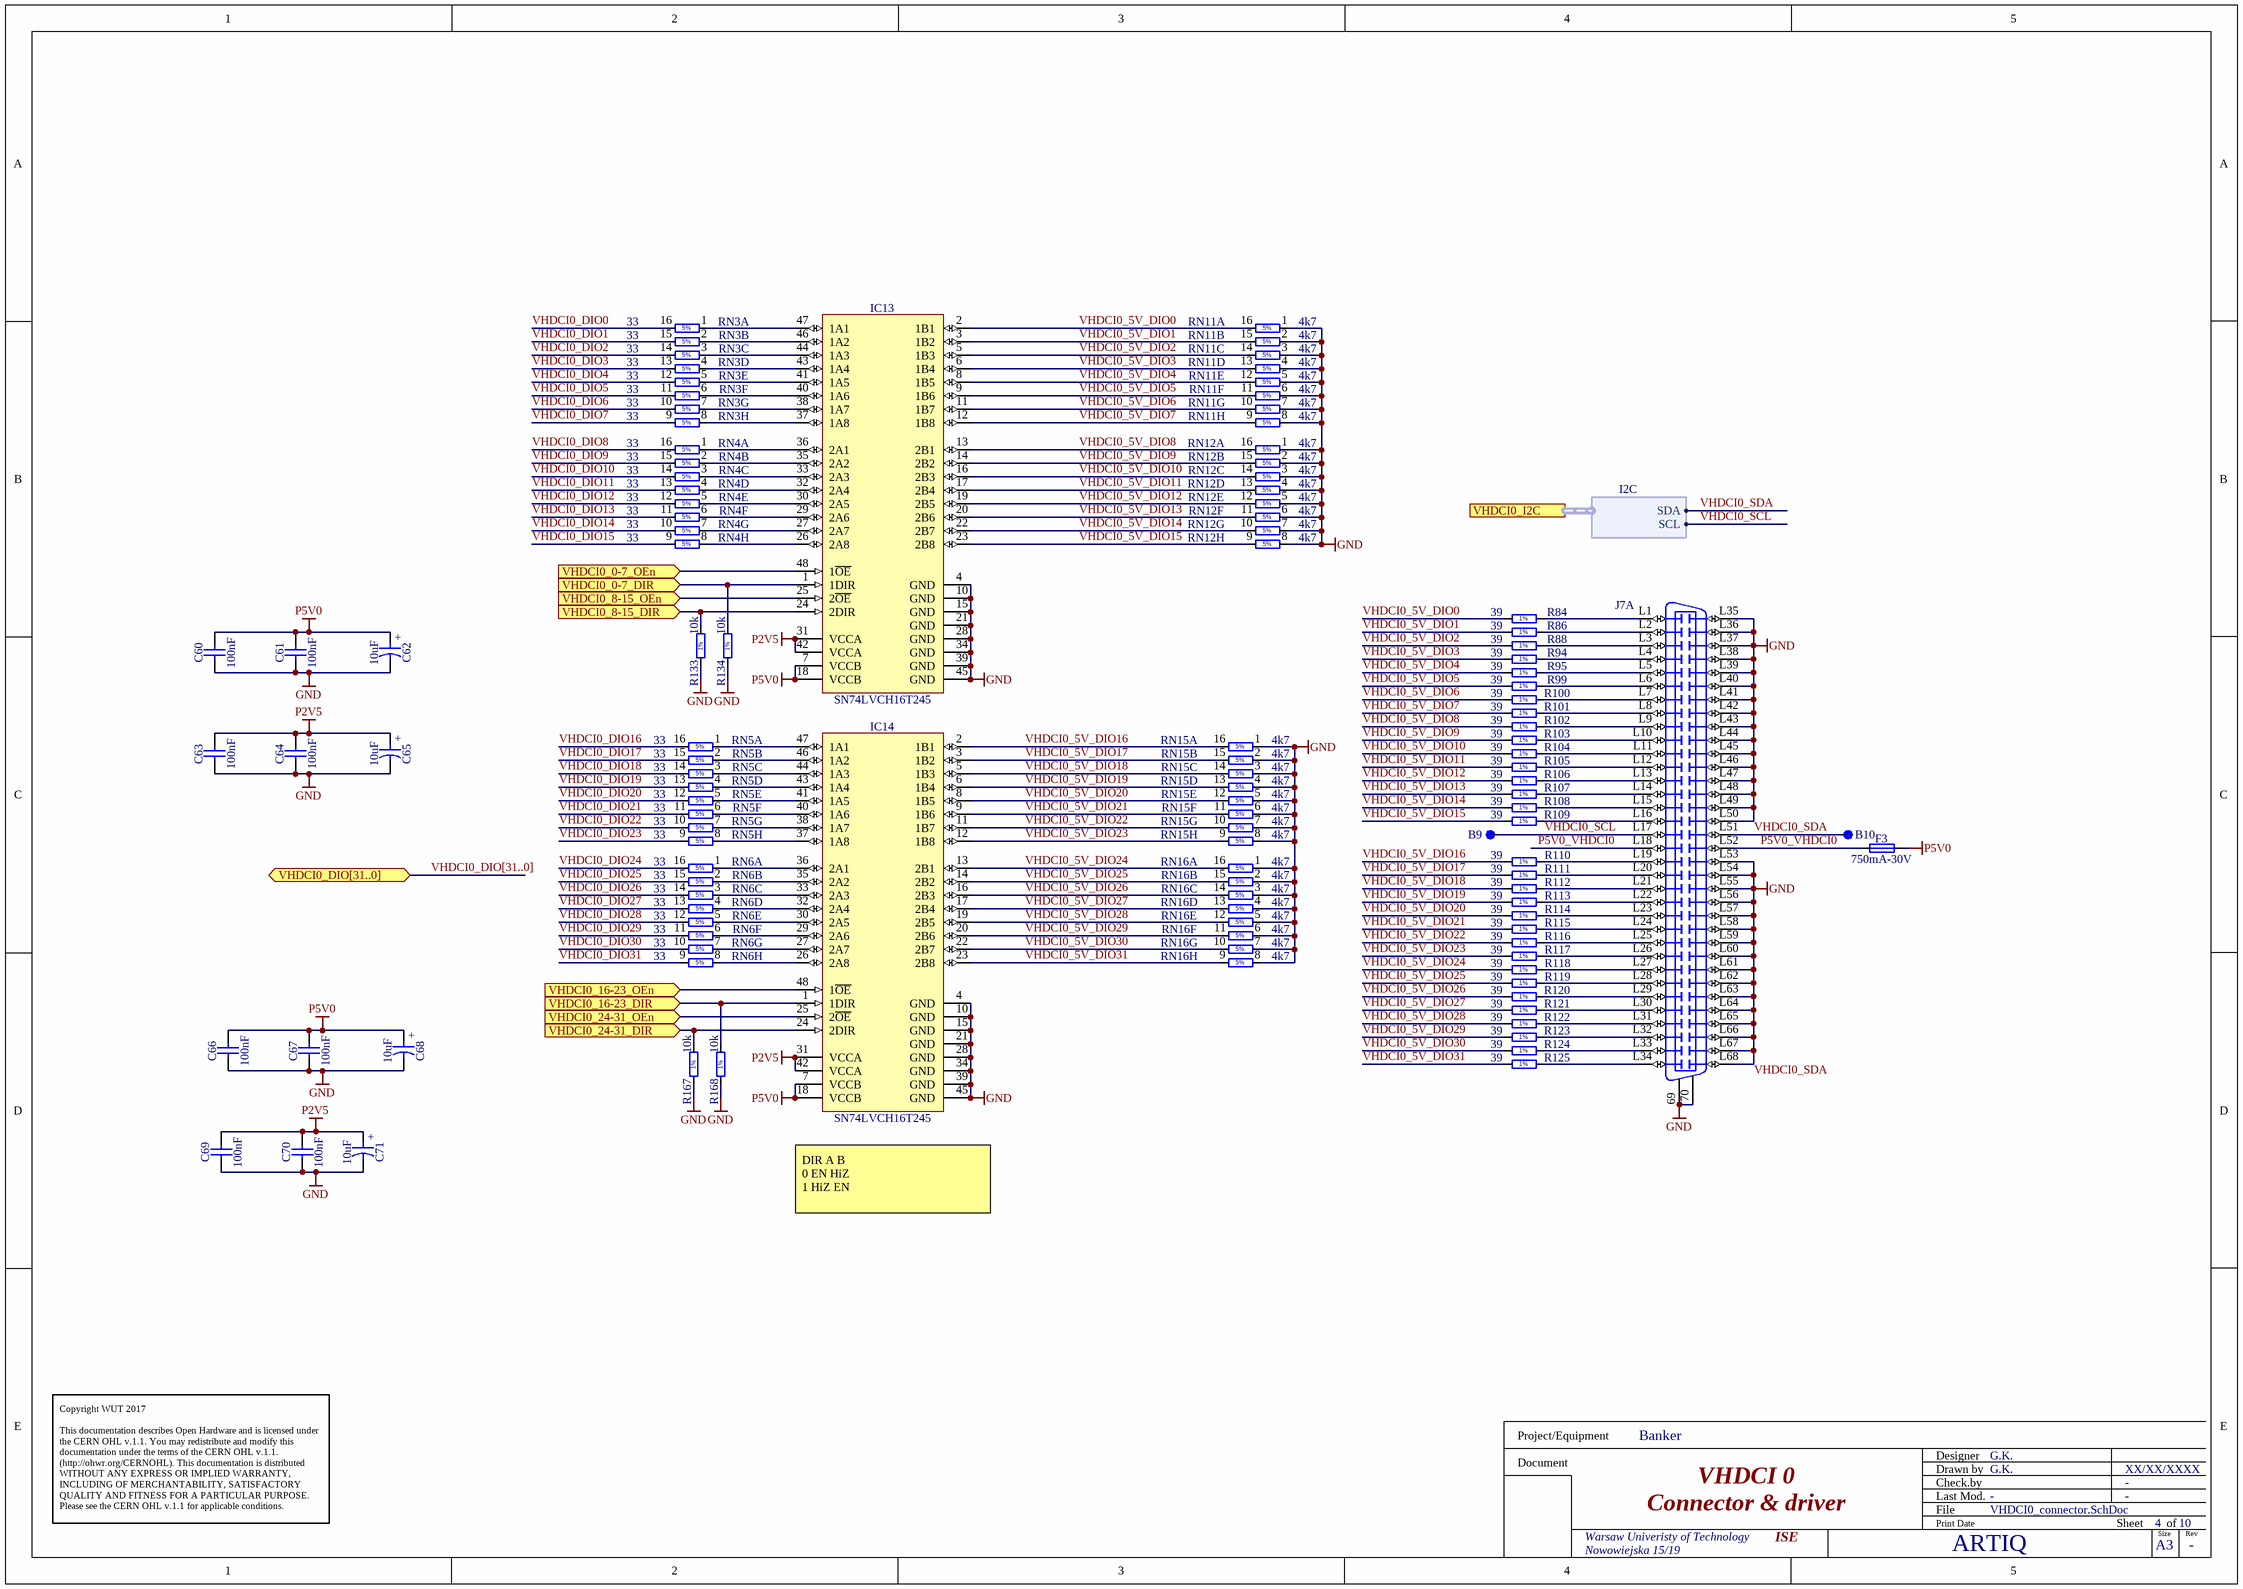
[diagram p2: VHDCI0_connector.SchDoc]

### Parts
B9  SMD Pad  [C100]  (value not drawn)
B10  SMD Pad  [C100]  (value not drawn)
C60  100nF  [CAPC1005X55N]
C61  100nF  [CAPC1005X55N]
C62  10uF  [CAPAE430X540N]
C63  100nF  [CAPC1005X55N]
C64  100nF  [CAPC1005X55N]
C65  10uF  [CAPAE430X540N]
C66  100nF  [CAPC1005X55N]
C67  100nF  [CAPC1005X55N]
C68  10uF  [CAPAE430X540N]
C69  100nF  [CAPC1005X55N]
C70  100nF  [CAPC1005X55N]
C71  10uF  [CAPAE430X540N]
F3  750mA-30V  [FUSR_BOURNS_MF-SM075]
IC13  SN74LVCH16T245  [SOP50P810X120-48N]
IC14  SN74LVCH16T245  [SOP50P810X120-48N]
J7  VHDCI  [MOLEX_74337-0015]  (value not drawn)  (part A of 2)
R84  39  [RESC2012X60N]
R86  39  [RESC2012X60N]
R88  39  [RESC2012X60N]
R94  39  [RESC2012X60N]
R95  39  [RESC2012X60N]
R99  39  [RESC2012X60N]
R100  39  [RESC2012X60N]
R101  39  [RESC2012X60N]
R102  39  [RESC2012X60N]
R103  39  [RESC2012X60N]
R104  39  [RESC2012X60N]
R105  39  [RESC2012X60N]
R106  39  [RESC2012X60N]
R107  39  [RESC2012X60N]
R108  39  [RESC2012X60N]
R109  39  [RESC2012X60N]
R110  39  [RESC2012X60N]
R111  39  [RESC2012X60N]
R112  39  [RESC2012X60N]
R113  39  [RESC2012X60N]
R114  39  [RESC2012X60N]
R115  39  [RESC2012X60N]
R116  39  [RESC2012X60N]
R117  39  [RESC2012X60N]
R118  39  [RESC2012X60N]
R119  39  [RESC2012X60N]
R120  39  [RESC2012X60N]
R121  39  [RESC2012X60N]
R122  39  [RESC2012X60N]
R123  39  [RESC2012X60N]
R124  39  [RESC2012X60N]
R125  39  [RESC2012X60N]
R133  10k  [RESC1005X40N]
R134  10k  [RESC1005X40N]
R167  10k  [RESC1005X40N]
R168  10k  [RESC1005X40N]
RN3  33  [RN_YAGEO_YC248]  (parts A,B,C,D,E,F,G,H of 8)
RN4  33  [RN_YAGEO_YC248]  (parts A,B,C,D,E,F,G,H of 8)
RN5  33  [RN_YAGEO_YC248]  (parts A,B,C,D,E,F,G,H of 8)
RN6  33  [RN_YAGEO_YC248]  (parts A,B,C,D,E,F,G,H of 8)
RN11  4k7  [RN_YAGEO_YC248]  (parts A,B,C,D,E,F,G,H of 8)
RN12  4k7  [RN_YAGEO_YC248]  (parts A,B,C,D,E,F,G,H of 8)
RN15  4k7  [RN_YAGEO_YC248]  (parts A,B,C,D,E,F,G,H of 8)
RN16  4k7  [RN_YAGEO_YC248]  (parts A,B,C,D,E,F,G,H of 8)

### Ports
VHDCI0_0-7_DIR (in), VHDCI0_0-7_OEn (in), VHDCI0_8-15_DIR (in), VHDCI0_8-15_OEn (in), VHDCI0_16-23_DIR (in), VHDCI0_16-23_OEn (in), VHDCI0_24-31_DIR (in), VHDCI0_24-31_OEn (in), VHDCI0_DIO[31..0] (bidir), VHDCI0_I2C (harness I2C)

### Harnesses
I2C: SDA, SCL

### Nets
GND: C60.1 C61.1 C62.2 C63.1 C64.1 C65.2 C66.1 C67.1 C68.2 C69.1 C70.1 C71.2 IC13.4(GND) IC13.10(GND) IC13.15(GND) IC13.21(GND) IC13.28(GND) IC13.34(GND) IC13.39(GND) IC13.45(GND) IC14.4(GND) IC14.10(GND) IC14.15(GND) IC14.21(GND) IC14.28(GND) IC14.34(GND) IC14.39(GND) IC14.45(GND) J7.69 J7.70 J7.L35 J7.L36 J7.L37 J7.L38 J7.L39 J7.L40 J7.L41 J7.L42 J7.L43 J7.L44 J7.L45 J7.L46 J7.L47 J7.L48 J7.L49 J7.L50 J7.L53 J7.L54 J7.L55 J7.L56 J7.L57 J7.L58 J7.L59 J7.L60 J7.L61 J7.L62 J7.L63 J7.L64 J7.L65 J7.L66 J7.L67 J7.L68 R133.1 R134.1 R167.1 R168.1 RN11.1 RN11.2 RN11.3 RN11.4 RN11.5 RN11.6 RN11.7 RN11.8 RN12.1 RN12.2 RN12.3 RN12.4 RN12.5 RN12.6 RN12.7 RN12.8 RN15.1 RN15.2 RN15.3 RN15.4 RN15.5 RN15.6 RN15.7 RN15.8 RN16.1 RN16.2 RN16.3 RN16.4 RN16.5 RN16.6 RN16.7 RN16.8
P2V5: C63.2 C64.2 C65.1 C69.2 C70.2 C71.1 IC13.31(VCCA) IC13.42(VCCA) IC14.31(VCCA) IC14.42(VCCA)
P5V0: C60.2 C61.2 C62.1 C66.2 C67.2 C68.1 F3.2 IC13.7(VCCB) IC13.18(VCCB) IC14.7(VCCB) IC14.18(VCCB)
DRV_OENn: IC13.25(2~{OE}) IC13.48(1~{OE}) IC14.25(2~{OE}) IC14.48(1~{OE}) ; port VHDCI0_0-7_OEn, port VHDCI0_8-15_OEn, port VHDCI0_16-23_OEn, port VHDCI0_24-31_OEn
P5V0_VHDCI0: F3.1 J7.L18 J7.L52
VHDCI0_0-7_DIR: IC13.1(1DIR) R134.2 ; port VHDCI0_0-7_DIR
VHDCI0_5V_DIO0: IC13.2(1B1) R84.1 RN11.16
VHDCI0_5V_DIO1: IC13.3(1B2) R86.1 RN11.15
VHDCI0_5V_DIO2: IC13.5(1B3) R88.1 RN11.14
VHDCI0_5V_DIO3: IC13.6(1B4) R94.1 RN11.13
VHDCI0_5V_DIO4: IC13.8(1B5) R95.1 RN11.12
VHDCI0_5V_DIO5: IC13.9(1B6) R99.1 RN11.11
VHDCI0_5V_DIO6: IC13.11(1B7) R100.1 RN11.10
VHDCI0_5V_DIO7: IC13.12(1B8) R101.1 RN11.9
VHDCI0_5V_DIO8: IC13.13(2B1) R102.1 RN12.16
VHDCI0_5V_DIO9: IC13.14(2B2) R103.1 RN12.15
VHDCI0_5V_DIO10: IC13.16(2B3) R104.1 RN12.14
VHDCI0_5V_DIO11: IC13.17(2B4) R105.1 RN12.13
VHDCI0_5V_DIO12: IC13.19(2B5) R106.1 RN12.12
VHDCI0_5V_DIO13: IC13.20(2B6) R107.1 RN12.11
VHDCI0_5V_DIO14: IC13.22(2B7) R108.1 RN12.10
VHDCI0_5V_DIO15: IC13.23(2B8) R109.1 RN12.9
VHDCI0_5V_DIO16: IC14.2(1B1) R110.1 RN15.16
VHDCI0_5V_DIO17: IC14.3(1B2) R111.1 RN15.15
VHDCI0_5V_DIO18: IC14.5(1B3) R112.1 RN15.14
VHDCI0_5V_DIO19: IC14.6(1B4) R113.1 RN15.13
VHDCI0_5V_DIO20: IC14.8(1B5) R114.1 RN15.12
VHDCI0_5V_DIO21: IC14.9(1B6) R115.1 RN15.11
VHDCI0_5V_DIO22: IC14.11(1B7) R116.1 RN15.10
VHDCI0_5V_DIO23: IC14.12(1B8) R117.1 RN15.9
VHDCI0_5V_DIO24: IC14.13(2B1) R118.1 RN16.16
VHDCI0_5V_DIO25: IC14.14(2B2) R119.1 RN16.15
VHDCI0_5V_DIO26: IC14.16(2B3) R120.1 RN16.14
VHDCI0_5V_DIO27: IC14.17(2B4) R121.1 RN16.13
VHDCI0_5V_DIO28: IC14.19(2B5) R122.1 RN16.12
VHDCI0_5V_DIO29: IC14.20(2B6) R123.1 RN16.11
VHDCI0_5V_DIO30: IC14.22(2B7) R124.1 RN16.10
VHDCI0_5V_DIO31: IC14.23(2B8) R125.1 RN16.9
VHDCI0_8-15_DIR: IC13.24(2DIR) R133.2 ; port VHDCI0_8-15_DIR
VHDCI0_16-23_DIR: IC14.1(1DIR) R168.2 ; port VHDCI0_16-23_DIR
VHDCI0_24-31_DIR: IC14.24(2DIR) R167.2 ; port VHDCI0_24-31_DIR
VHDCI0_DIO0: RN3.16
VHDCI0_DIO1: RN3.15
VHDCI0_DIO2: RN3.14
VHDCI0_DIO3: RN3.13
VHDCI0_DIO4: RN3.12
VHDCI0_DIO5: RN3.11
VHDCI0_DIO6: RN3.10
VHDCI0_DIO7: RN3.9
VHDCI0_DIO8: RN4.16
VHDCI0_DIO9: RN4.15
VHDCI0_DIO10: RN4.14
VHDCI0_DIO11: RN4.13
VHDCI0_DIO12: RN4.12
VHDCI0_DIO13: RN4.11
VHDCI0_DIO14: RN4.10
VHDCI0_DIO15: RN4.9
VHDCI0_DIO16: RN5.16
VHDCI0_DIO17: RN5.15
VHDCI0_DIO18: RN5.14
VHDCI0_DIO19: RN5.13
VHDCI0_DIO20: RN5.12
VHDCI0_DIO21: RN5.11
VHDCI0_DIO22: RN5.10
VHDCI0_DIO23: RN5.9
VHDCI0_DIO24: RN6.16
VHDCI0_DIO25: RN6.15
VHDCI0_DIO26: RN6.14
VHDCI0_DIO27: RN6.13
VHDCI0_DIO28: RN6.12
VHDCI0_DIO29: RN6.11
VHDCI0_DIO30: RN6.10
VHDCI0_DIO31: RN6.9
VHDCI0_SCL: B9.1 J7.L17 ; port VHDCI0_I2C.SCL
VHDCI0_SDA: B10.1 J7.L51 ; port VHDCI0_I2C.SDA
NetIC13_26: IC13.26(2A8) RN4.8
NetIC13_27: IC13.27(2A7) RN4.7
NetIC13_29: IC13.29(2A6) RN4.6
NetIC13_30: IC13.30(2A5) RN4.5
NetIC13_32: IC13.32(2A4) RN4.4
NetIC13_33: IC13.33(2A3) RN4.3
NetIC13_35: IC13.35(2A2) RN4.2
NetIC13_36: IC13.36(2A1) RN4.1
NetIC13_37: IC13.37(1A8) RN3.8
NetIC13_38: IC13.38(1A7) RN3.7
NetIC13_40: IC13.40(1A6) RN3.6
NetIC13_41: IC13.41(1A5) RN3.5
NetIC13_43: IC13.43(1A4) RN3.4
NetIC13_44: IC13.44(1A3) RN3.3
NetIC13_46: IC13.46(1A2) RN3.2
NetIC13_47: IC13.47(1A1) RN3.1
NetIC14_26: IC14.26(2A8) RN6.8
NetIC14_27: IC14.27(2A7) RN6.7
NetIC14_29: IC14.29(2A6) RN6.6
NetIC14_30: IC14.30(2A5) RN6.5
NetIC14_32: IC14.32(2A4) RN6.4
NetIC14_33: IC14.33(2A3) RN6.3
NetIC14_35: IC14.35(2A2) RN6.2
NetIC14_36: IC14.36(2A1) RN6.1
NetIC14_37: IC14.37(1A8) RN5.8
NetIC14_38: IC14.38(1A7) RN5.7
NetIC14_40: IC14.40(1A6) RN5.6
NetIC14_41: IC14.41(1A5) RN5.5
NetIC14_43: IC14.43(1A4) RN5.4
NetIC14_44: IC14.44(1A3) RN5.3
NetIC14_46: IC14.46(1A2) RN5.2
NetIC14_47: IC14.47(1A1) RN5.1
NetJ7_L1: J7.L1 R84.2
NetJ7_L2: J7.L2 R86.2
NetJ7_L3: J7.L3 R88.2
NetJ7_L4: J7.L4 R94.2
NetJ7_L5: J7.L5 R95.2
NetJ7_L6: J7.L6 R99.2
NetJ7_L7: J7.L7 R100.2
NetJ7_L8: J7.L8 R101.2
NetJ7_L9: J7.L9 R102.2
NetJ7_L10: J7.L10 R103.2
NetJ7_L11: J7.L11 R104.2
NetJ7_L12: J7.L12 R105.2
NetJ7_L13: J7.L13 R106.2
NetJ7_L14: J7.L14 R107.2
NetJ7_L15: J7.L15 R108.2
NetJ7_L16: J7.L16 R109.2
NetJ7_L19: J7.L19 R110.2
NetJ7_L20: J7.L20 R111.2
NetJ7_L21: J7.L21 R112.2
NetJ7_L22: J7.L22 R113.2
NetJ7_L23: J7.L23 R114.2
NetJ7_L24: J7.L24 R115.2
NetJ7_L25: J7.L25 R116.2
NetJ7_L26: J7.L26 R117.2
NetJ7_L27: J7.L27 R118.2
NetJ7_L28: J7.L28 R119.2
NetJ7_L29: J7.L29 R120.2
NetJ7_L30: J7.L30 R121.2
NetJ7_L31: J7.L31 R122.2
NetJ7_L32: J7.L32 R123.2
NetJ7_L33: J7.L33 R124.2
NetJ7_L34: J7.L34 R125.2

### Buses and harness runs
bus VHDCI0_DIO[31..0] = port VHDCI0_DIO[31..0]

### Notes on the sheet
- (near IC14) DIR	A	B
  0	EN	HiZ
  1	HiZ	EN
- Copyright WUT 2017
  This documentation describes Open Hardware and is licensed under the CERN OHL v.1.1. You may redistribute and modify this documentation under the terms of the CERN OHL v.1.1. (http://ohwr.org/CERNOHL). This documentation is distributed WITHOUT ANY EXPRESS OR IMPLIED WARRANTY, INCLUDING OF MERCHANTABILITY, SATISFACTORY QUALITY AND FITNESS FOR A PARTICULAR PURPOSE. Please see the CERN OHL v.1.1 for applicable conditions.
- Labels drawn without touching a wire or pin: VHDCI0_SDA
- Project/Equipment
- Document
- Designer
- Drawn by
- Check.by
- File
- Last Mod.
- Print Date
- Sheet
- Size
- A3
- of
- Rev
- (in symbol CAE430-540_10UF_16V_20%) +
- (in symbol R0402_10K_1%_0.0625W_100PPM) 1%
- (in symbol R0805_39R_1%_0.125W_100PPM) 1%
- (in symbol RES_RN_4K7_YAGEO_YC248-JR-074K7L, part A) 5%
- (in symbol RES_RN_4K7_YAGEO_YC248-JR-074K7L, part B) 5%
- (in symbol RES_RN_4K7_YAGEO_YC248-JR-074K7L, part C) 5%
- (in symbol RES_RN_4K7_YAGEO_YC248-JR-074K7L, part D) 5%
- (in symbol RES_RN_4K7_YAGEO_YC248-JR-074K7L, part E) 5%
- (in symbol RES_RN_4K7_YAGEO_YC248-JR-074K7L, part F) 5%
- (in symbol RES_RN_4K7_YAGEO_YC248-JR-074K7L, part G) 5%
- (in symbol RES_RN_4K7_YAGEO_YC248-JR-074K7L, part H) 5%
- (in symbol RN_33R_YAGEO_YC248-JR-0733RL, part A) 5%
- (in symbol RN_33R_YAGEO_YC248-JR-0733RL, part B) 5%
- (in symbol RN_33R_YAGEO_YC248-JR-0733RL, part C) 5%
- (in symbol RN_33R_YAGEO_YC248-JR-0733RL, part D) 5%
- (in symbol RN_33R_YAGEO_YC248-JR-0733RL, part E) 5%
- (in symbol RN_33R_YAGEO_YC248-JR-0733RL, part F) 5%
- (in symbol RN_33R_YAGEO_YC248-JR-0733RL, part G) 5%
- (in symbol RN_33R_YAGEO_YC248-JR-0733RL, part H) 5%

### Library data of the parts
B9 B10 = SMD_PAD_D1MM: as B14 on sheet FPGA_LVDS; Part Number: SMD_PAD_D1MM; Component Kind: Standard (No BOM); Component Type: Standard (No BOM); Pin Count: 1; Family: SMD Pad; Socket: No; SMD: No; Sense: No; Status: None; ComponentHeight: 0mm; HelpURL: Undefined; Author: CERN DEM JLC; CreateDate: 10.10.2017; LatestRevisionDate: 10.10.2017; PackageDescription: 1mm Diameter SMD Pad
C60 C61 C63 C64 C66 C67 C69 C70 = CC0402_100NF_16V_10%_X5R: Non-polarised capacitor; Part Description: SMD Multilayer Chip Ceramic Capacitor; Manufacturer: GENERIC; Manufacturer1 Part Number: GRM155R61C104KA88D; Voltage: 16V; TC: X5R; Tolerance: ±10%; Part Number: CC0402_100NF_16V_10%_X5R; Component Kind: Standard; Component Type: Standard; Pin Count: 2; Value: 100nF; Status: None; Manufacturer Part Number: CC0402_100NF_16V_10%_X5R; Case: 0402; Mounted: Yes; Socket: No; SMD: Yes; Sense: No; Manufacturer1 Example: MURATA; Manufacturer1 ComponentHeight: 0.55mm; HelpURL: \\cern.ch\dfs\Applications\Altium\Datasheets\CC0402_X5R_MURATA_GRM.pdf; Author: CERN DEM JLC; CreateDate: 10.12.2013; LatestRevisionDate: 10.12.2013
C62 C65 C68 C71 = CAE430-540_10UF_16V_20%: Polarised capacitor; Part Description: Aluminum Electrolytic SMT Capacitor; Manufacturer: PANASONIC; Manufacturer Part Number: EEEFK1C100AR; Voltage: 16V; Tolerance: ±20%; Part Number: CAE430-540_10UF_16V_20%; Component Kind: Standard; Component Type: Standard; Pin Count: 2; Value: 10uF; Status: Not Recommended; Case: B; Mounted: Yes; Socket: No; SMD: Yes; Sense: No; ComponentHeight: 5.8mm; HelpURL: \\cern.ch\dfs\Applications\Altium\Datasheets\CAE_PANASONIC_FK.pdf; Author: CERN DEM JLC; CreateDate: 03.12.2007; LatestRevisionDate: 05.11.2014
F3 = FUSR_BOURNS_MF-SM075-2: Fuse; Part Description: PTC Resettable Fuse; Manufacturer: BOURNS; PressFit: No; Part Number: FUSR_BOURNS_MF-SM075-2; Component Kind: Standard; Component Type: Standard; Pin Count: 2; PackageDescription: PolySwitch, 2-Leads, Body 7.35x5.12mm Nominal; Family: Fuses Resettable; Mounted: Yes; Socket: No; SMD: Yes; Sense: No; Value: 750mA-30V; Manufacturer Part Number: MF-SM075-2; ComponentHeight: 3.18mm; HelpURL: \\cern.ch\dfs\Applications\Altium\Datasheets\FUSR_BOURNS_MF-SM075-2.pdf; Author: CERN DEM JLC; CreateDate: 01/03/2012; LatestRevisionDate: 07/11/2012
IC13 IC14 = 74LVCH16T245: 16-Bit Dual-Supply Bus Transceiver With Configurable Voltage Translation And 3-State Outputs; Part Number: SN74LVCH16T245DGGR; Part Description: 16-Bit Dual-Supply Bus Transceivers With Configurable Voltage Translation And 3-State Outputs; Manufacturer: TEXAS INSTRUMENTS; PressFit: No; Bonding: No; Component Kind: Standard; Component Type: Standard; Device: SN74LVCH16T245; PackageDescription: SOP, 48-Leads, Body 12.6x6.2mm (max), Pitch 0.50mm, IPC Medium Density; Manufacturer Part Number: SN74LVCH16T245DGGR; Pin Count: 48; Case: TSSOP48; Mounted: Yes; Socket: No; SMD: Yes; Sense: No; ComponentHeight: 1.2mm; Author: GK; HelpURL: \\cern.ch\dfs\Applications\Altium\Datasheets\CLVCH16T245MDGGREP.pdf; CreateDate: 09/02/2016; LatestRevisionDate: 09/02/2016
J7 = MOLEX_74337-0015: Very High Density Cable Interconnect (VHDCI ) 2x68 Female; Part Number: Delivered by GK; Part Description: 2x68 Positions, Pitch 0.8mm, Very Hight Density Right Angle Dual Stacked VHDCI Receptacle; Manufacturer: MOLEX; PressFit: No; Component Kind: Standard; Component Type: Standard; Pin Count: 140; Family: VHDCI; Mounted: Yes; Socket: No; SMD: No; Sense: No; Status: None; Manufacturer Part Number: Delivered by GK; ComponentHeight: 10.78mm; HelpURL: \\cern.ch\dfs\Applications\Altium\Datasheets\MOLEX_74337-0015.pdf; Author: CERN DEM JLC; CreateDate: 30.04.2014; LatestRevisionDate: 30.04.2014
R84 R86 R88 R94 R95 R99-R125 = R0805_39R_1%_0.125W_100PPM: Resistor - 1%; Part Description: General Purpose Thick Film Chip Resistor; Manufacturer: GENERIC; Manufacturer1 Part Number: NRC10F39R0TRF; Power: 0.125W; TC: ±100ppm/°C; PressFit: No; Part Number: R0805_39R_1%_0.125W_100PPM; Component Kind: Standard; Component Type: Standard; Pin Count: 2; Value: 39; Status: Preferred; Tolerance: ±1%; Manufacturer Part Number: R0805_39R_1%_0.125W_100PPM; Case: 0805; Mounted: Yes; Sense: No; Socket: No; SMD: Yes; Manufacturer1 Example: NIC COMPONENT; Manufacturer1 ComponentHeight: 0.6mm; HelpURL: \\cern.ch\dfs\Applications\Altium\Datasheets\R0805_NIC_NRC.pdf; Author: CERN DEM JLC; CreateDate: 03/12/2007; LatestRevisionDate: 13/03/2008
R133 R134 R167 R168 = R0402_10K_1%_0.0625W_100PPM: Resistor - 1%; Part Description: General Purpose Thick Film Chip Resistor; Manufacturer: GENERIC; Manufacturer1 Part Number: 232270671003L; TC: ±100ppm/°C; PressFit: No; Part Number: R0402_10K_1%_0.0625W_100PPM; Component Kind: Standard; Component Type: Standard; Pin Count: 2; Value: 10k; Status: Not Recommended; Power: 0.0625W; Tolerance: ±1%; Manufacturer Part Number: R0402_10K_1%_0.0625W_100PPM; Case: 0402; Mounted: Yes; Sense: No; Socket: No; SMD: Yes; Manufacturer1 Example: YAGEO PHYCOMP; Manufacturer1 ComponentHeight: 0.4mm; HelpURL: \\cern.ch\dfs\Applications\Altium\Datasheets\R0402_Phycomp_RC0402.pdf; Author: CERN DEM JLC; CreateDate: 03/12/2007; LatestRevisionDate: 17/10/2012
RN3-RN6 = RN_33R_YAGEO_YC248-JR-0733RL: DIL16 Resistor Network 8 Isolated Resistor 5%; Part Description: Chip Resistor Array , 8 Isolated Resistors (Side Convex Terminal), YC248 Series; Manufacturer: YAGEO; Power: 0.062W; PressFit: No; TC: ±200ppm/°C; Part Number: RN_33R_YAGEO_YC248-JR-0733RL; Component Kind: Standard; Component Type: Standard; Pin Count: 16; Value: 33; Sense: No; Tolerance: ±5%; Manufacturer Part Number: YC248-JR-0733RL; Mounted: Yes; Socket: No; SMD: Yes; ComponentHeight: 0.55mm; HelpURL: \\cern.ch\dfs\Applications\Altium\Datasheets\RN_YAGEO_YC248.pdf; Author: CERN DEM JLC; CreateDate: 13/01/2011; LatestRevisionDate: 13/01/2011
RN11 RN12 RN15 RN16 = RES_RN_4K7_YAGEO_YC248-JR-074K7L: 8x Resistor Network  Isolated Resistor 5%; Part Number: RN_33R_YAGEO_YC248-JR-074K7L; Part Description: Chip Resistor Array , 8 Isolated Resistors (Side Convex Terminal), YC248 Series; Manufacturer: YAGEO; Power: 0.062W; PressFit: No; TC: ±200ppm/°C; Component Kind: Standard; Component Type: Standard; Pin Count: 16; Value: 4k7; Sense: No; Tolerance: ±5%; Manufacturer Part Number: YC248-JR-074K7L; Mounted: Yes; Socket: No; SMD: Yes; ComponentHeight: 0.55mm; HelpURL: \\cern.ch\dfs\Applications\Altium\Datasheets\RN_YAGEO_YC248.pdf; Author: GK; CreateDate: 13/01/2011; LatestRevisionDate: 13/01/2011

## Sheet IDC_connectors.SchDoc: IDC
size 420 x 297 mm; Author: G.K.; CompanyName: WUT; DrawnBy: G.K.; Organization: CERN; Address1: Warsaw Univeristy of Technology; Address2: Nowowiejska 15/19; DocumentNumber: 7; Revision: -; SheetNumber: 7; SheetTotal: 10; EDA_Number: ARTIQ; Projet: Banker; ModifiedBy: -; CreateDate: XX/XX/XXXX; CheckedDate: -; Title2: Connector & driver; DivGrp: ISE; Designer: G.K.; ModifiedDate: -; ProjectName: ADC/DAC MEZZANINE
Used 4 times, as channels U_IDC_connectors0, U_IDC_connectors1, U_IDC_connectors2, U_IDC_connectors3. Parts and nets are listed once, with the designators drawn on the sheet.
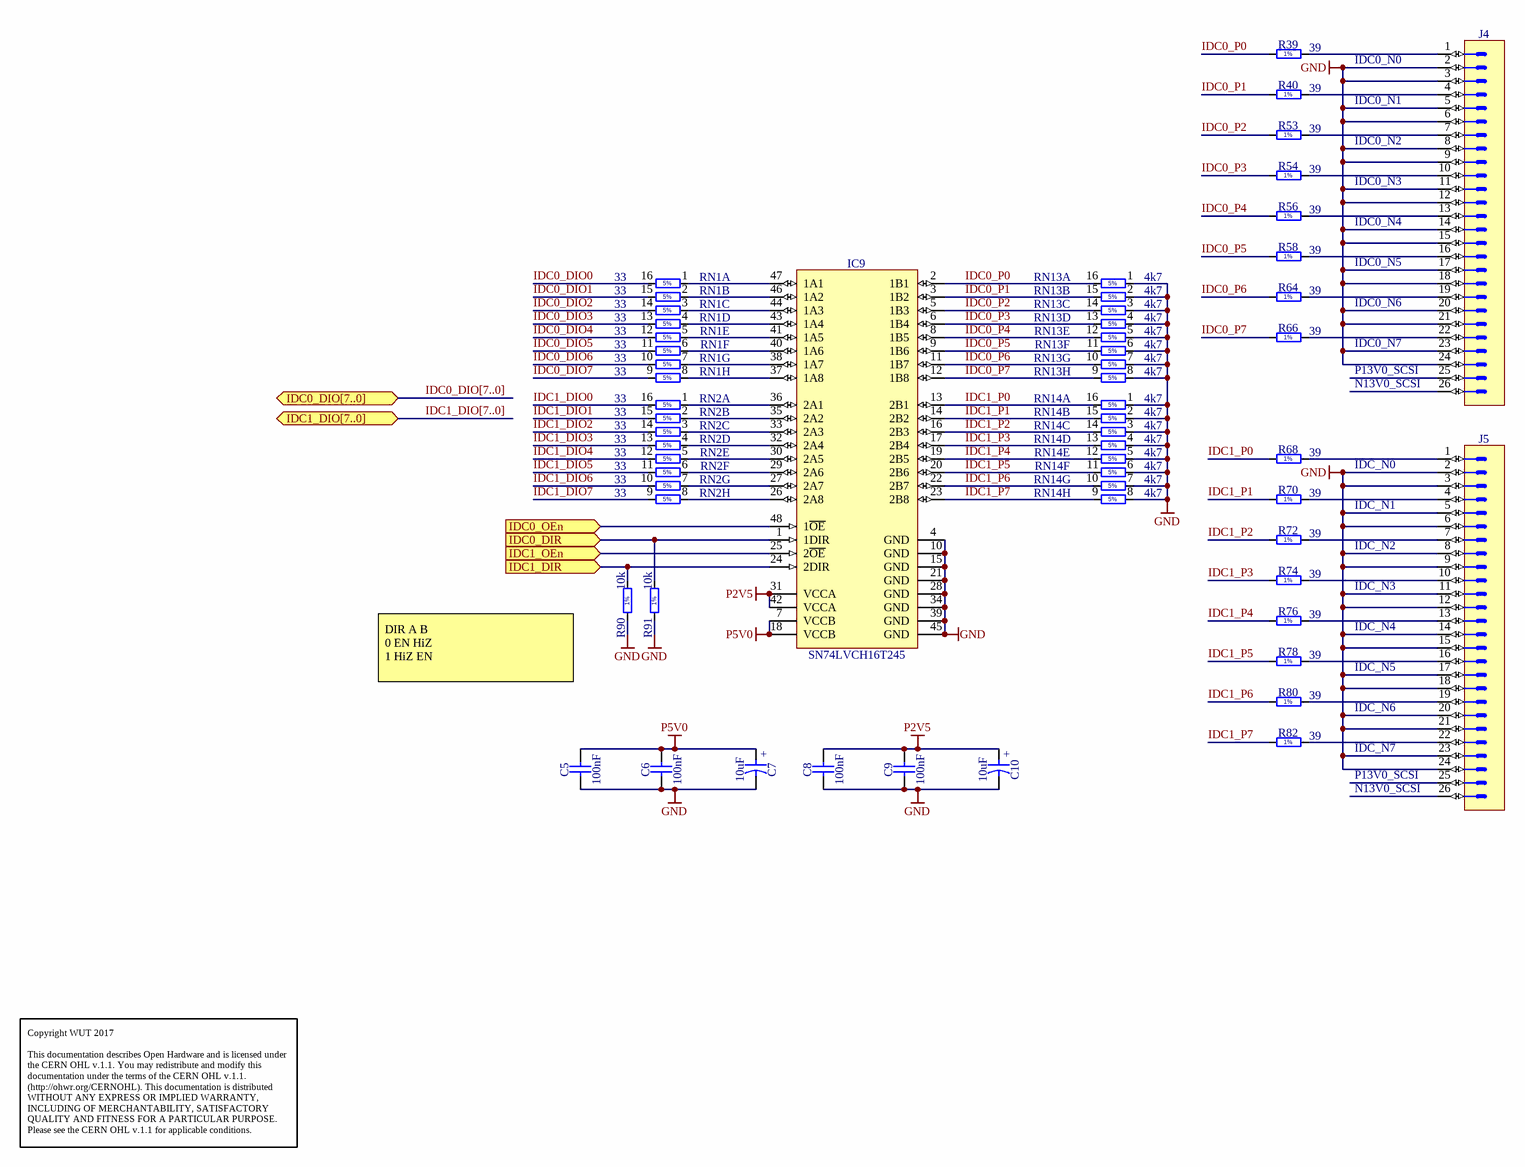
[diagram p3: IDC_connectors.SchDoc]

### Parts
C5  100nF  [CAPC1005X55N]
C6  100nF  [CAPC1005X55N]
C7  10uF  [CAPAE430X540N]
C8  100nF  [CAPC1005X55N]
C9  100nF  [CAPC1005X55N]
C10  10uF  [CAPAE430X540N]
IC9  SN74LVCH16T245  [SOP50P810X120-48N]
J4  Header 26  [3M_N2526-6003RB]  (value not drawn)
J5  Header 26  [3M_N2526-6003RB]  (value not drawn)
R39  39  [RESC2012X60N]
R40  39  [RESC2012X60N]
R53  39  [RESC2012X60N]
R54  39  [RESC2012X60N]
R56  39  [RESC2012X60N]
R58  39  [RESC2012X60N]
R64  39  [RESC2012X60N]
R66  39  [RESC2012X60N]
R68  39  [RESC2012X60N]
R70  39  [RESC2012X60N]
R72  39  [RESC2012X60N]
R74  39  [RESC2012X60N]
R76  39  [RESC2012X60N]
R78  39  [RESC2012X60N]
R80  39  [RESC2012X60N]
R82  39  [RESC2012X60N]
R90  10k  [RESC1005X40N]
R91  10k  [RESC1005X40N]
RN1  33  [RN_YAGEO_YC248]  (parts A,B,C,D,E,F,G,H of 8)
RN2  33  [RN_YAGEO_YC248]  (parts A,B,C,D,E,F,G,H of 8)
RN13  4k7  [RN_YAGEO_YC248]  (parts A,B,C,D,E,F,G,H of 8)
RN14  4k7  [RN_YAGEO_YC248]  (parts A,B,C,D,E,F,G,H of 8)

### Ports
IDC0_DIO[7..0] (bidir), IDC0_DIR (in), IDC0_OEn (in), IDC1_DIO[7..0] (bidir), IDC1_DIR (in), IDC1_OEn (in)

### Nets
GND: C5.1 C6.1 C7.2 C8.1 C9.1 C10.2 IC9.4(GND) IC9.10(GND) IC9.15(GND) IC9.21(GND) IC9.28(GND) IC9.34(GND) IC9.39(GND) IC9.45(GND) J4.2 J4.3 J4.5 J4.6 J4.8 J4.9 J4.11 J4.12 J4.14 J4.15 J4.17 J4.18 J4.20 J4.21 J4.23 J4.24 J5.2 J5.3 J5.5 J5.6 J5.8 J5.9 J5.11 J5.12 J5.14 J5.15 J5.17 J5.18 J5.20 J5.21 J5.23 J5.24 R90.1 R91.1 RN13.1 RN13.2 RN13.3 RN13.4 RN13.5 RN13.6 RN13.7 RN13.8 RN14.1 RN14.2 RN14.3 RN14.4 RN14.5 RN14.6 RN14.7 RN14.8
P2V5: C8.2 C9.2 C10.1 IC9.31(VCCA) IC9.42(VCCA)
P5V0: C5.2 C6.2 C7.1 IC9.7(VCCB) IC9.18(VCCB)
IDC0_DIO0: RN1.16
IDC0_DIO1: RN1.15
IDC0_DIO2: RN1.14
IDC0_DIO3: RN1.13
IDC0_DIO4: RN1.12
IDC0_DIO5: RN1.11
IDC0_DIO6: RN1.10
IDC0_DIO7: RN1.9
IDC0_DIR: IC9.1(1DIR) R91.2 ; port IDC0_DIR
IDC0_OEn: IC9.48(1~{OE}) ; port IDC0_OEn
IDC0_P0: IC9.2(1B1) R39.1 RN13.16
IDC0_P1: IC9.3(1B2) R40.1 RN13.15
IDC0_P2: IC9.5(1B3) R53.1 RN13.14
IDC0_P3: IC9.6(1B4) R54.1 RN13.13
IDC0_P4: IC9.8(1B5) R56.1 RN13.12
IDC0_P5: IC9.9(1B6) R58.1 RN13.11
IDC0_P6: IC9.11(1B7) R64.1 RN13.10
IDC0_P7: IC9.12(1B8) R66.1 RN13.9
IDC1_DIO0: RN2.16
IDC1_DIO1: RN2.15
IDC1_DIO2: RN2.14
IDC1_DIO3: RN2.13
IDC1_DIO4: RN2.12
IDC1_DIO5: RN2.11
IDC1_DIO6: RN2.10
IDC1_DIO7: RN2.9
IDC1_DIR: IC9.24(2DIR) R90.2 ; port IDC1_DIR
IDC1_OEn: IC9.25(2~{OE}) ; port IDC1_OEn
IDC1_P0: IC9.13(2B1) R68.1 RN14.16
IDC1_P1: IC9.14(2B2) R70.1 RN14.15
IDC1_P2: IC9.16(2B3) R72.1 RN14.14
IDC1_P3: IC9.17(2B4) R74.1 RN14.13
IDC1_P4: IC9.19(2B5) R76.1 RN14.12
IDC1_P5: IC9.20(2B6) R78.1 RN14.11
IDC1_P6: IC9.22(2B7) R80.1 RN14.10
IDC1_P7: IC9.23(2B8) R82.1 RN14.9
NetIC9_26: IC9.26(2A8) RN2.8
NetIC9_27: IC9.27(2A7) RN2.7
NetIC9_29: IC9.29(2A6) RN2.6
NetIC9_30: IC9.30(2A5) RN2.5
NetIC9_32: IC9.32(2A4) RN2.4
NetIC9_33: IC9.33(2A3) RN2.3
NetIC9_35: IC9.35(2A2) RN2.2
NetIC9_36: IC9.36(2A1) RN2.1
NetIC9_37: IC9.37(1A8) RN1.8
NetIC9_38: IC9.38(1A7) RN1.7
NetIC9_40: IC9.40(1A6) RN1.6
NetIC9_41: IC9.41(1A5) RN1.5
NetIC9_43: IC9.43(1A4) RN1.4
NetIC9_44: IC9.44(1A3) RN1.3
NetIC9_46: IC9.46(1A2) RN1.2
NetIC9_47: IC9.47(1A1) RN1.1
NetJ4_1: J4.1 R39.2
NetJ4_4: J4.4 R40.2
NetJ4_7: J4.7 R53.2
NetJ4_10: J4.10 R54.2
NetJ4_13: J4.13 R56.2
NetJ4_16: J4.16 R58.2
NetJ4_19: J4.19 R64.2
NetJ4_22: J4.22 R66.2
NetJ5_1: J5.1 R68.2
NetJ5_4: J5.4 R70.2
NetJ5_7: J5.7 R72.2
NetJ5_10: J5.10 R74.2
NetJ5_13: J5.13 R76.2
NetJ5_16: J5.16 R78.2
NetJ5_19: J5.19 R80.2
NetJ5_22: J5.22 R82.2

Not connected (* = marked no-connect by the designer): J4 25 26; J5 25 26

### Channels
U_IDC_connectors0: designators end in A; ports IDC0_DIR=IDC0_DIR IDC0_OEn=DRV_OENn IDC1_DIR=IDC1_DIR IDC1_OEn=DRV_OENn
U_IDC_connectors1: designators end in B; ports IDC0_DIR=IDC2_DIR IDC0_OEn=DRV_OENn IDC1_DIR=IDC3_DIR IDC1_OEn=DRV_OENn
U_IDC_connectors2: designators end in C; ports IDC0_DIR=IDC4_DIR IDC0_OEn=DRV_OENn IDC1_DIR=IDC5_DIR IDC1_OEn=DRV_OENn
U_IDC_connectors3: designators end in D; ports IDC0_DIR=IDC6_DIR IDC0_OEn=DRV_OENn IDC1_DIR=IDC7_DIR IDC1_OEn=DRV_OENn

### Buses and harness runs
bus IDC0_DIO[7..0] = port IDC0_DIO[7..0]
bus IDC1_DIO[7..0] = port IDC1_DIO[7..0]

### Notes on the sheet
- IDC0_N0
- IDC0_N1
- IDC0_N2
- IDC0_N3
- IDC0_N4
- IDC0_N5
- IDC0_N6
- IDC0_N7
- P13V0_SCSI
- N13V0_SCSI
- IDC_N0
- IDC_N1
- IDC_N2
- IDC_N3
- DIR	A	B
  0	EN	HiZ
  1	HiZ	EN
- IDC_N4
- IDC_N5
- IDC_N6
- IDC_N7
- Copyright WUT 2017
  This documentation describes Open Hardware and is licensed under the CERN OHL v.1.1. You may redistribute and modify this documentation under the terms of the CERN OHL v.1.1. (http://ohwr.org/CERNOHL). This documentation is distributed WITHOUT ANY EXPRESS OR IMPLIED WARRANTY, INCLUDING OF MERCHANTABILITY, SATISFACTORY QUALITY AND FITNESS FOR A PARTICULAR PURPOSE. Please see the CERN OHL v.1.1 for applicable conditions.
- Project/Equipment
- Document
- Designer
- Drawn by
- Check.by
- File
- Last Mod.
- Print Date
- Sheet
- Size
- A3
- of
- Rev
- (in symbol CAE430-540_10UF_16V_20%) +
- (in symbol R0402_10K_1%_0.0625W_100PPM) 1%
- (in symbol R0805_39R_1%_0.125W_100PPM) 1%
- (in symbol RES_RN_4K7_YAGEO_YC248-JR-074K7L, part A) 5%
- (in symbol RES_RN_4K7_YAGEO_YC248-JR-074K7L, part B) 5%
- (in symbol RES_RN_4K7_YAGEO_YC248-JR-074K7L, part C) 5%
- (in symbol RES_RN_4K7_YAGEO_YC248-JR-074K7L, part D) 5%
- (in symbol RES_RN_4K7_YAGEO_YC248-JR-074K7L, part E) 5%
- (in symbol RES_RN_4K7_YAGEO_YC248-JR-074K7L, part F) 5%
- (in symbol RES_RN_4K7_YAGEO_YC248-JR-074K7L, part G) 5%
- (in symbol RES_RN_4K7_YAGEO_YC248-JR-074K7L, part H) 5%
- (in symbol RN_33R_YAGEO_YC248-JR-0733RL, part A) 5%
- (in symbol RN_33R_YAGEO_YC248-JR-0733RL, part B) 5%
- (in symbol RN_33R_YAGEO_YC248-JR-0733RL, part C) 5%
- (in symbol RN_33R_YAGEO_YC248-JR-0733RL, part D) 5%
- (in symbol RN_33R_YAGEO_YC248-JR-0733RL, part E) 5%
- (in symbol RN_33R_YAGEO_YC248-JR-0733RL, part F) 5%
- (in symbol RN_33R_YAGEO_YC248-JR-0733RL, part G) 5%
- (in symbol RN_33R_YAGEO_YC248-JR-0733RL, part H) 5%

### Library data of the parts
C5 C6 C8 C9 = CC0402_100NF_16V_10%_X5R: as C60 on sheet VHDCI0_connector; Part Number: CC0402_100NF_16V_10%_X5R; Component Kind: Standard; Component Type: Standard; Pin Count: 2; Value: 100nF; Status: None; Manufacturer Part Number: CC0402_100NF_16V_10%_X5R; Case: 0402; Mounted: Yes; Socket: No; SMD: Yes; Sense: No; Manufacturer1 Example: MURATA; Manufacturer1 ComponentHeight: 0.55mm; HelpURL: \\cern.ch\dfs\Applications\Altium\Datasheets\CC0402_X5R_MURATA_GRM.pdf; Author: CERN DEM JLC; CreateDate: 10.12.2013; LatestRevisionDate: 10.12.2013
C7 C10 = CAE430-540_10UF_16V_20%: as C62 on sheet VHDCI0_connector; Part Number: CAE430-540_10UF_16V_20%; Component Kind: Standard; Component Type: Standard; Pin Count: 2; Value: 10uF; Status: Not Recommended; Case: B; Mounted: Yes; Socket: No; SMD: Yes; Sense: No; ComponentHeight: 5.8mm; HelpURL: \\cern.ch\dfs\Applications\Altium\Datasheets\CAE_PANASONIC_FK.pdf; Author: CERN DEM JLC; CreateDate: 03.12.2007; LatestRevisionDate: 05.11.2014
IC9 = 74LVCH16T245: as IC13 on sheet VHDCI0_connector; Component Kind: Standard; Component Type: Standard; Device: SN74LVCH16T245; PackageDescription: SOP, 48-Leads, Body 12.6x6.2mm (max), Pitch 0.50mm, IPC Medium Density; Manufacturer Part Number: SN74LVCH16T245DGGR; Pin Count: 48; Case: TSSOP48; Mounted: Yes; Socket: No; SMD: Yes; Sense: No; ComponentHeight: 1.2mm; Author: GK; HelpURL: \\cern.ch\dfs\Applications\Altium\Datasheets\CLVCH16T245MDGGREP.pdf; CreateDate: 09/02/2016; LatestRevisionDate: 09/02/2016
J4 J5 = 3M_N2526-6003RB: Connector 26 Male; Part Description: 26 Contacts - Straight .100'' x .100'' Low Profile Four-Wall Header, 2500 Series; Manufacturer: 3M; PressFit: No; Part Number: 3M_N2526-6003RB; Component Kind: Standard; Component Type: Standard; Pin Count: 26; Family: Header 26; Mounted: Yes; Socket: No; SMD: No; Sense: No; Status: None; Manufacturer Part Number: N2526-6003RB; ComponentHeight: 9.91mm; HelpURL: \\cern.ch\dfs\Applications\Altium\Datasheets\3M_N2526-6003RB.pdf; Author: CERN DEM JLC; CreateDate: 22.01.2014; LatestRevisionDate: 22.01.2014
R39 R40 R53 R54 R56 R58 R64 R66 R68 R70 R72 R74 R76 R78 R80 R82 = R0805_39R_1%_0.125W_100PPM: as R84 on sheet VHDCI0_connector; Part Number: R0805_39R_1%_0.125W_100PPM; Component Kind: Standard; Component Type: Standard; Pin Count: 2; Value: 39; Status: Preferred; Tolerance: ±1%; Manufacturer Part Number: R0805_39R_1%_0.125W_100PPM; Case: 0805; Mounted: Yes; Sense: No; Socket: No; SMD: Yes; Manufacturer1 Example: NIC COMPONENT; Manufacturer1 ComponentHeight: 0.6mm; HelpURL: \\cern.ch\dfs\Applications\Altium\Datasheets\R0805_NIC_NRC.pdf; Author: CERN DEM JLC; CreateDate: 03/12/2007; LatestRevisionDate: 13/03/2008
R90 R91 = R0402_10K_1%_0.0625W_100PPM: as R133 on sheet VHDCI0_connector; Part Number: R0402_10K_1%_0.0625W_100PPM; Component Kind: Standard; Component Type: Standard; Pin Count: 2; Value: 10k; Status: Not Recommended; Power: 0.0625W; Tolerance: ±1%; Manufacturer Part Number: R0402_10K_1%_0.0625W_100PPM; Case: 0402; Mounted: Yes; Sense: No; Socket: No; SMD: Yes; Manufacturer1 Example: YAGEO PHYCOMP; Manufacturer1 ComponentHeight: 0.4mm; HelpURL: \\cern.ch\dfs\Applications\Altium\Datasheets\R0402_Phycomp_RC0402.pdf; Author: CERN DEM JLC; CreateDate: 03/12/2007; LatestRevisionDate: 17/10/2012
RN1 RN2 = RN_33R_YAGEO_YC248-JR-0733RL: as RN3 on sheet VHDCI0_connector; Part Number: RN_33R_YAGEO_YC248-JR-0733RL; Component Kind: Standard; Component Type: Standard; Pin Count: 16; Value: 33; Sense: No; Tolerance: ±5%; Manufacturer Part Number: YC248-JR-0733RL; Mounted: Yes; Socket: No; SMD: Yes; ComponentHeight: 0.55mm; HelpURL: \\cern.ch\dfs\Applications\Altium\Datasheets\RN_YAGEO_YC248.pdf; Author: CERN DEM JLC; CreateDate: 13/01/2011; LatestRevisionDate: 13/01/2011
RN13 RN14 = RES_RN_4K7_YAGEO_YC248-JR-074K7L: as RN11 on sheet VHDCI0_connector; Component Kind: Standard; Component Type: Standard; Pin Count: 16; Value: 4k7; Sense: No; Tolerance: ±5%; Manufacturer Part Number: YC248-JR-074K7L; Mounted: Yes; Socket: No; SMD: Yes; ComponentHeight: 0.55mm; HelpURL: \\cern.ch\dfs\Applications\Altium\Datasheets\RN_YAGEO_YC248.pdf; Author: GK; CreateDate: 13/01/2011; LatestRevisionDate: 13/01/2011